# Altium project RF-lxSpark_1v0.PrjPcb (part 1 of 3)
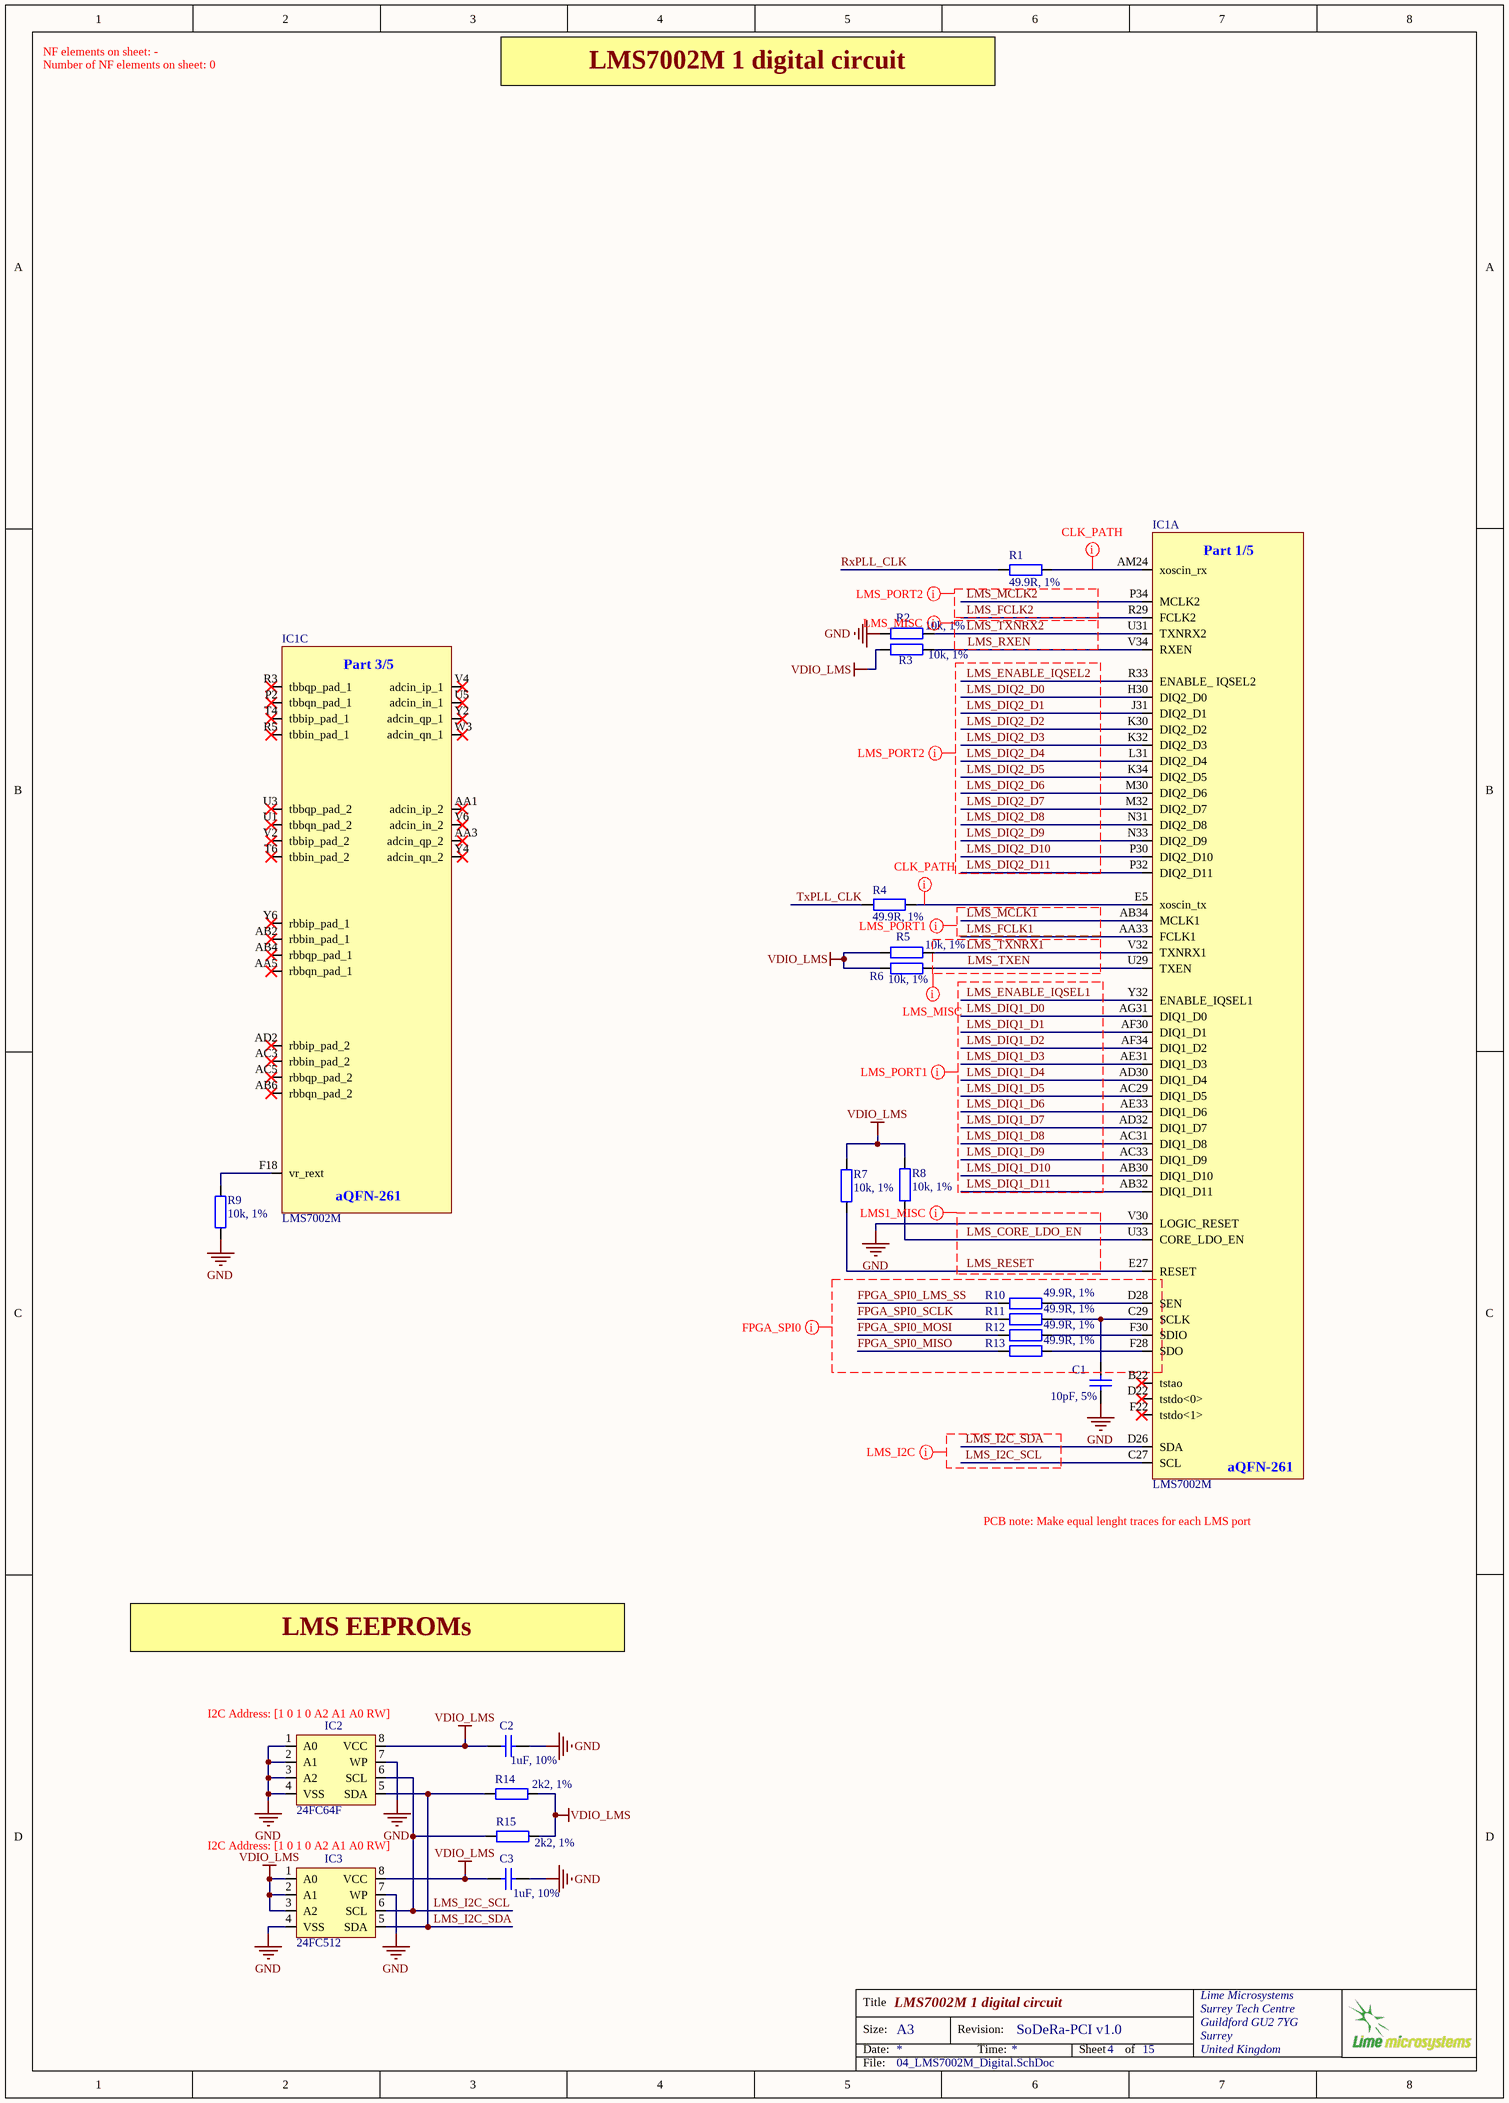
[diagram p0: 04_LMS7002M_Digital.SchDoc]
8 sheets, 396 parts. Net scope: global (net labels, ports and power ports of the same name join across sheets).
Board file: SoDeRa-PCIe_1v0.PcbDoc
Sheets:
  04_LMS7002M_Digital.SchDoc
  07_FPGA_banks_3_4_5.SchDoc
  08_FPGA_banks_6_7_8.SchDoc
  09_FPGA_misc.SchDoc
  11_DDR2.SchDoc
  12_Periphs.SchDoc
  13_Clocks_1.SchDoc
  15_BoardPowerSupply.SchDoc

## Sheet 04_LMS7002M_Digital.SchDoc: LMS7002M 1 digital circuit
size A3 portrait; Organization: Lime Microsystems; Address1: Surrey Tech Centre; Address2: Guildford GU2 7YG; Address3: Surrey; Address4: United Kingdom; Revision: SoDeRa-PCI v1.0; SheetNumber: 4; SheetTotal: 15

### Parts
C1  10pF, 5%  [CAP0402]
C2  1uF, 10%  [CAP0402]
C3  1uF, 10%  [CAP0402]
IC1  LMS7002M  [LMS7002M]  (parts A,C of 5)
IC2  24FC64F  [24FC512]
IC3  24FC512  [24FC512]
R1  49.9R, 1%  [RES0402]
R2  10k, 1%  [RES0402]
R3  10k, 1%  [RES0402]
R4  49.9R, 1%  [RES0402]
R5  10k, 1%  [RES0402]
R6  10k, 1%  [RES0402]
R7  10k, 1%  [RES0402]
R8  10k, 1%  [RES0402]
R9  10k, 1%  [RES0402]
R10  49.9R, 1%  [RES0402]
R11  49.9R, 1%  [RES0402]
R12  49.9R, 1%  [RES0402]
R13  49.9R, 1%  [RES0402]
R14  2k2, 1%  [RES0402]
R15  2k2, 1%  [RES0402]

### Nets
GND: C1.2 C2.1 C3.1 IC1.V30(LOGIC_RESET) IC2.1(A0) IC2.2(A1) IC2.3(A2) IC2.4(VSS) IC2.7(WP) IC3.4(VSS) IC3.7(WP) R2.1 R9.2
VDIO_LMS: C2.2 C3.2 IC2.8(VCC) IC3.1(A0) IC3.2(A1) IC3.3(A2) IC3.8(VCC) R3.1 R5.1 R6.1 R7.2 R8.2 R14.1 R15.1
FPGA_SPI0_LMS_SS: R10.2
FPGA_SPI0_MISO: R13.2
FPGA_SPI0_MOSI: R12.2
FPGA_SPI0_SCLK: R11.2
LMS_CORE_LDO_EN: IC1.U33(CORE_LDO_EN) R8.1
LMS_DIQ1_D0: IC1.AG31(DIQ1_D0)
LMS_DIQ1_D1: IC1.AF30(DIQ1_D1)
LMS_DIQ1_D2: IC1.AF34(DIQ1_D2)
LMS_DIQ1_D3: IC1.AE31(DIQ1_D3)
LMS_DIQ1_D4: IC1.AD30(DIQ1_D4)
LMS_DIQ1_D5: IC1.AC29(DIQ1_D5)
LMS_DIQ1_D6: IC1.AE33(DIQ1_D6)
LMS_DIQ1_D7: IC1.AD32(DIQ1_D7)
LMS_DIQ1_D8: IC1.AC31(DIQ1_D8)
LMS_DIQ1_D9: IC1.AC33(DIQ1_D9)
LMS_DIQ1_D10: IC1.AB30(DIQ1_D10)
LMS_DIQ1_D11: IC1.AB32(DIQ1_D11)
LMS_DIQ2_D0: IC1.H30(DIQ2_D0)
LMS_DIQ2_D1: IC1.J31(DIQ2_D1)
LMS_DIQ2_D2: IC1.K30(DIQ2_D2)
LMS_DIQ2_D3: IC1.K32(DIQ2_D3)
LMS_DIQ2_D4: IC1.L31(DIQ2_D4)
LMS_DIQ2_D5: IC1.K34(DIQ2_D5)
LMS_DIQ2_D6: IC1.M30(DIQ2_D6)
LMS_DIQ2_D7: IC1.M32(DIQ2_D7)
LMS_DIQ2_D8: IC1.N31(DIQ2_D8)
LMS_DIQ2_D9: IC1.N33(DIQ2_D9)
LMS_DIQ2_D10: IC1.P30(DIQ2_D10)
LMS_DIQ2_D11: IC1.P32(DIQ2_D11)
LMS_ENABLE_IQSEL1: IC1.Y32(ENABLE_IQSEL1)
LMS_ENABLE_IQSEL2: IC1.R33(ENABLE__IQSEL2)
LMS_FCLK1: IC1.AA33(FCLK1)
LMS_FCLK2: IC1.R29(FCLK2)
LMS_I2C_SCL: IC1.C27(SCL) IC2.6(SCL) IC3.6(SCL) R15.2
LMS_I2C_SDA: IC1.D26(SDA) IC2.5(SDA) IC3.5(SDA) R14.2
LMS_MCLK1: IC1.AB34(MCLK1)
LMS_MCLK2: IC1.P34(MCLK2)
LMS_RESET: IC1.E27(RESET) R7.1
LMS_RXEN: IC1.V34(RXEN) R3.2
LMS_TXEN: IC1.U29(TXEN) R6.2
LMS_TXNRX1: IC1.V32(TXNRX1) R5.2
LMS_TXNRX2: IC1.U31(TXNRX2) R2.2
RxPLL_CLK: R1.2
TxPLL_CLK: R4.2
NetC1_1: C1.1 IC1.C29(SCLK) R11.1
NetIC1_AM24: IC1.AM24(xoscin_rx) R1.1
NetIC1_D28: IC1.D28(SEN) R10.1
NetIC1_E5: IC1.E5(xoscin_tx) R4.1
NetIC1_F18: IC1.F18(vr_rext) R9.1
NetIC1_F28: IC1.F28(SDO) R13.1
NetIC1_F30: IC1.F30(SDIO) R12.1

Not connected (* = marked no-connect by the designer): IC1 AA1(adcin_ip_2)* AA3(adcin_qp_2)* AA5(rbbqn_pad_1)* AB2(rbbin_pad_1)* AB4(rbbqp_pad_1)* AB6(rbbqn_pad_2)* AC3(rbbin_pad_2)* AC5(rbbqp_pad_2)* AD2(rbbip_pad_2)* B22(tstao)* D22(tstdo<0>)* F22(tstdo<1>)* P2(tbbqn_pad_1)* R3(tbbqp_pad_1)* R5(tbbin_pad_1)* T4(tbbip_pad_1)* T6(tbbin_pad_2)* U1(tbbqn_pad_2)* U3(tbbqp_pad_2)* U5(adcin_in_1)* V2(tbbip_pad_2)* V4(adcin_ip_1)* V6(adcin_in_2)* W3(adcin_qn_1)* Y2(adcin_qp_1)* Y4(adcin_qn_2)* Y6(rbbip_pad_1)*

### Layout directives
net class CLK_PATH: NetIC1_AM24, NetIC1_E5
net class FPGA_SPI0: FPGA_SPI0_LMS_SS, FPGA_SPI0_MISO, FPGA_SPI0_MOSI, FPGA_SPI0_SCLK
net class LMS_I2C: LMS_I2C_SCL, LMS_I2C_SDA
net class LMS_PORT2: LMS_DIQ2_D0, LMS_DIQ2_D1, LMS_DIQ2_D2, LMS_DIQ2_D3, LMS_DIQ2_D4, LMS_DIQ2_D5, LMS_DIQ2_D6, LMS_DIQ2_D7, LMS_DIQ2_D8, LMS_DIQ2_D9, LMS_DIQ2_D10, LMS_DIQ2_D11, LMS_ENABLE_IQSEL2, LMS_MCLK2
net class LMS_MISC: LMS_TXEN, LMS_TXNRX1, LMS_TXNRX2
net class LMS_PORT1: LMS_DIQ1_D0, LMS_DIQ1_D1, LMS_DIQ1_D2, LMS_DIQ1_D3, LMS_DIQ1_D4, LMS_DIQ1_D5, LMS_DIQ1_D6, LMS_DIQ1_D7, LMS_DIQ1_D8, LMS_DIQ1_D9, LMS_DIQ1_D10, LMS_DIQ1_D11, LMS_ENABLE_IQSEL1, LMS_MCLK1
net class MISC_LMS1: LMS_CORE_LDO_EN, LMS_RESET

### Notes on the sheet
- NF elements on sheet: -
- Number of NF elements on sheet: 0
- LMS7002M 1 digital circuit
- (near IC1) PCB note: Make equal lenght traces for each LMS port
- LMS EEPROMs
- (near IC2) I2C Address: [1 0 1 0 A2 A1 A0 RW]
- (near IC3) I2C Address: [1 0 1 0 A2 A1 A0 RW]
- Title
- Size:
- Date:
- A3
- Revision:
- Time:
- Sheet
- of
- File:
- (in symbol LMS7002M, part A) Part 1/5; aQFN-261
- (in symbol LMS7002M, part C) Part 3/5; aQFN-261

### Library data of the parts
C1 = Cap_0402: Manufacturer Part Number 1: 04023A100JAT2A; Manufacturer: AVX; Voltage Rating: 25; Ceramic Capacitor Case: 0402 [1005 Metric]; Capacitor Case Style: 0402 [1005 Metric]<!--FANDB--><div class="features-and-benefits-container"></div>; Dielectric Characteristic: C0G / NP0; SVHC: No SVHC (16-Jun-2014); Capacitance: 10; Value: 10pF, 5%; Supplier 1: Farnell; Supplier Part Number 1: 2332478RL; Capacitance Tolerance: ± 5%; Product Range: -; RoHS: YES; Operating Temperature Min: -55; Operating Temperature Max: 125; Capacitance Tolerance ±: ± 5%; MSL: MSL 1 - Unlimited; Packaging: Cut Tape
C2 C3 = Cap_0402: Manufacturer Part Number 1: GRM155R61A105KE15J; Manufacturer: TDK; Voltage Rating: 10; Product Range: TDK - C Series; Ceramic Capacitor Case: 0402 [1005 Metric]; Capacitance: 1; Dielectric Characteristic: X6; Value: 1uF, 10%; Supplier 1: Newark; Supplier Part Number 1: 490-6298-2-ND; Capacitance Tolerance: ± 10%; MSL: -; RoHS: YES
IC2 = 24FC64F: Manufacturer Part Number 1: 24FC64F-I/ST; Manufacturer: Microchip Technology; Format - Memory: EEPROMs - Serial; Speed: 400kHz, 1MHz; Interface: I²C, 2-Wire Serial; Memory Type: EEPROM; Memory Size: 64K (8K x 8); Voltage - Supply: 1.7 V ~ 5.5 V; Supplier 1: Digi-Key; Packaging: Tube; Supplier Device Package: 8-TSSOP; Operating Temperature: -40°C ~ 85°C; RoHS: RoHS Compliant; Category: Integrated Circuits (ICs); Package / Case: 8-TSSOP (0.173", 4.40mm Width); Supplier Part Number 1: 24FC64F-I/ST-ND
IC3 = 24FC512: Manufacturer Part Number 1: 24FC512-I/ST; Manufacturer: Microchip Technology; Speed: 400kHz, 1MHz; Memory Type: EEPROM; Memory Size: 512K (64K x 8); Voltage - Supply: 1.7 V ~ 5.5 V; Interface: I²C, 2-Wire Serial; Format - Memory: EEPROMs - Serial; Supplier 1: Digi-Key; RoHS: RoHS Compliant; Packaging: Tube; Operating Temperature: -40°C ~ 85°C; Supplier Device Package: 8-TSSOP; Category: Integrated Circuits (ICs); Package / Case: 8-TSSOP (0.173", 4.40mm Width); Supplier Part Number 1: 24FC512-I/ST-ND
R1 R4 R10-R13 = Res_0402: Manufacturer: Samsung Electro-Mechanics America, Inc.; Manufacturer Part Number: RC1005F49R9CS; Temperature Coefficient: ±100ppm/°C; Resistance (Ohms): 49.9; Power (Watts): 0.063W, 1/16W; Number of Terminations: 2; Size / Dimension: 0.039" L x 0.020" W (1.00mm x 0.50mm); Supplier Device Package: 0402 (1005 Metric); RoHS: RoHS Compliant; Supplier Part Number 1: 1276-3469-6-ND; Features: -; Packaging: Digi-Reel®; Tolerance: ±1%; Height: 0.016" (0.40mm); Category: Resistors; Composition: Thick Film; Package / Case: 0402 (1005 Metric); Supplier 1: Digi-Key; Operating Temperature: -55°C ~ 155°C; Value: 49.9R, 1%
R2 R3 R5-R9 = Res_0402: Manufacturer: Yageo; Manufacturer Part Number 1: RC0402FR-0710KL; Temperature Coefficient: ±100ppm/°C; Power (Watts): 0.063W, 1/16W; Value: 10k, 1%; Supplier 1: Digi-Key; Supplier Part Number 1: 311-10.0KLRTR-ND; Resistance (Ohms): 10k; Packaging: Tape & Reel (TR); RoHS: RoHS Compliant; Package / Case: 0402 (1005 Metric); Tolerance: ±1%; Operating Temperature: -55°C ~ 155°C; Size / Dimension: 0.039" L x 0.020" W (1.00mm x 0.50mm); Number of Terminations: 2; Category: Resistors; Height: 0.016" (0.40mm); Supplier Device Package: 0402; Features: Moisture Resistant; Composition: Thick Film
R14 R15 = Res_0402: Manufacturer: Stackpole Electronics Inc; Manufacturer Part Number 1: RMCF0402FT2K20; Resistance (Ohms): 2.2k; Temperature Coefficient: ±100ppm/°C; Power (Watts): 0.063W, 1/16W; Value: 2k2, 1%; Supplier 1: Digi-Key; Supplier Part Number 1: RMCF0402FT2K20CT-ND; Supplier Device Package: 0402; Package / Case: 0402 (1005 Metric); Size / Dimension: 0.039" L x 0.020" W (1.00mm x 0.50mm); Operating Temperature: -55°C ~ 155°C; Composition: Thick Film; Category: Resistors; Features: -; Height: 0.016" (0.40mm); RoHS: RoHS Compliant; Number of Terminations: 2; Packaging: Cut Tape (CT); Tolerance: ±1%
IC1 = LMS7002M: Manufacturer Part Number 1: LMS7002M; Supplier 1: Lime Microsystems; Supplier Part Number 1: Lime Microsystems

## Sheet 07_FPGA_banks_3_4_5.SchDoc: FPGA banks 3, 4, 5
size A3; Organization: Lime Microsystems; Address1: Surrey Tech Centre; Address2: Guildford GU2 7YG; Address3: Surrey; Address4: United Kingdom; Revision: SoDeRa-PCI v1.0; SheetNumber: 7; SheetTotal: 15
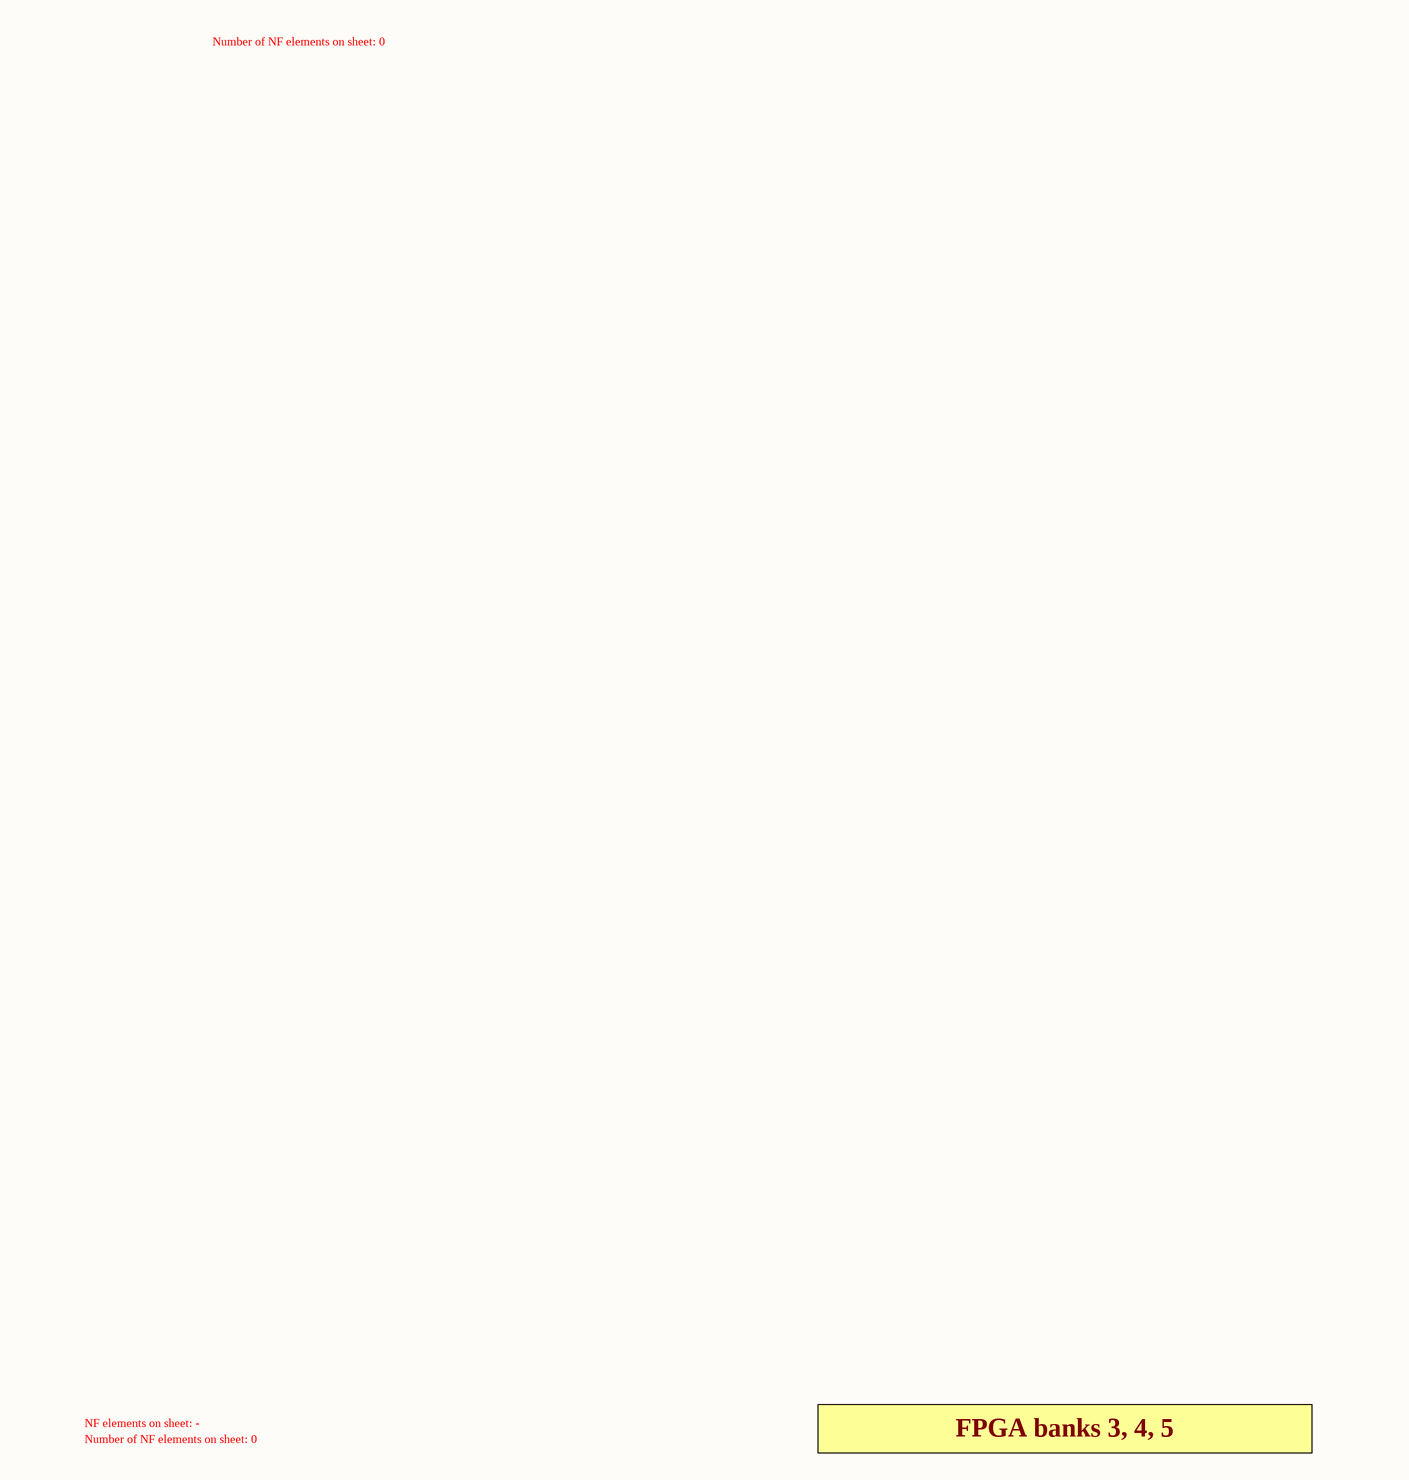
[diagram p1: 07_FPGA_banks_3_4_5.SchDoc, top]
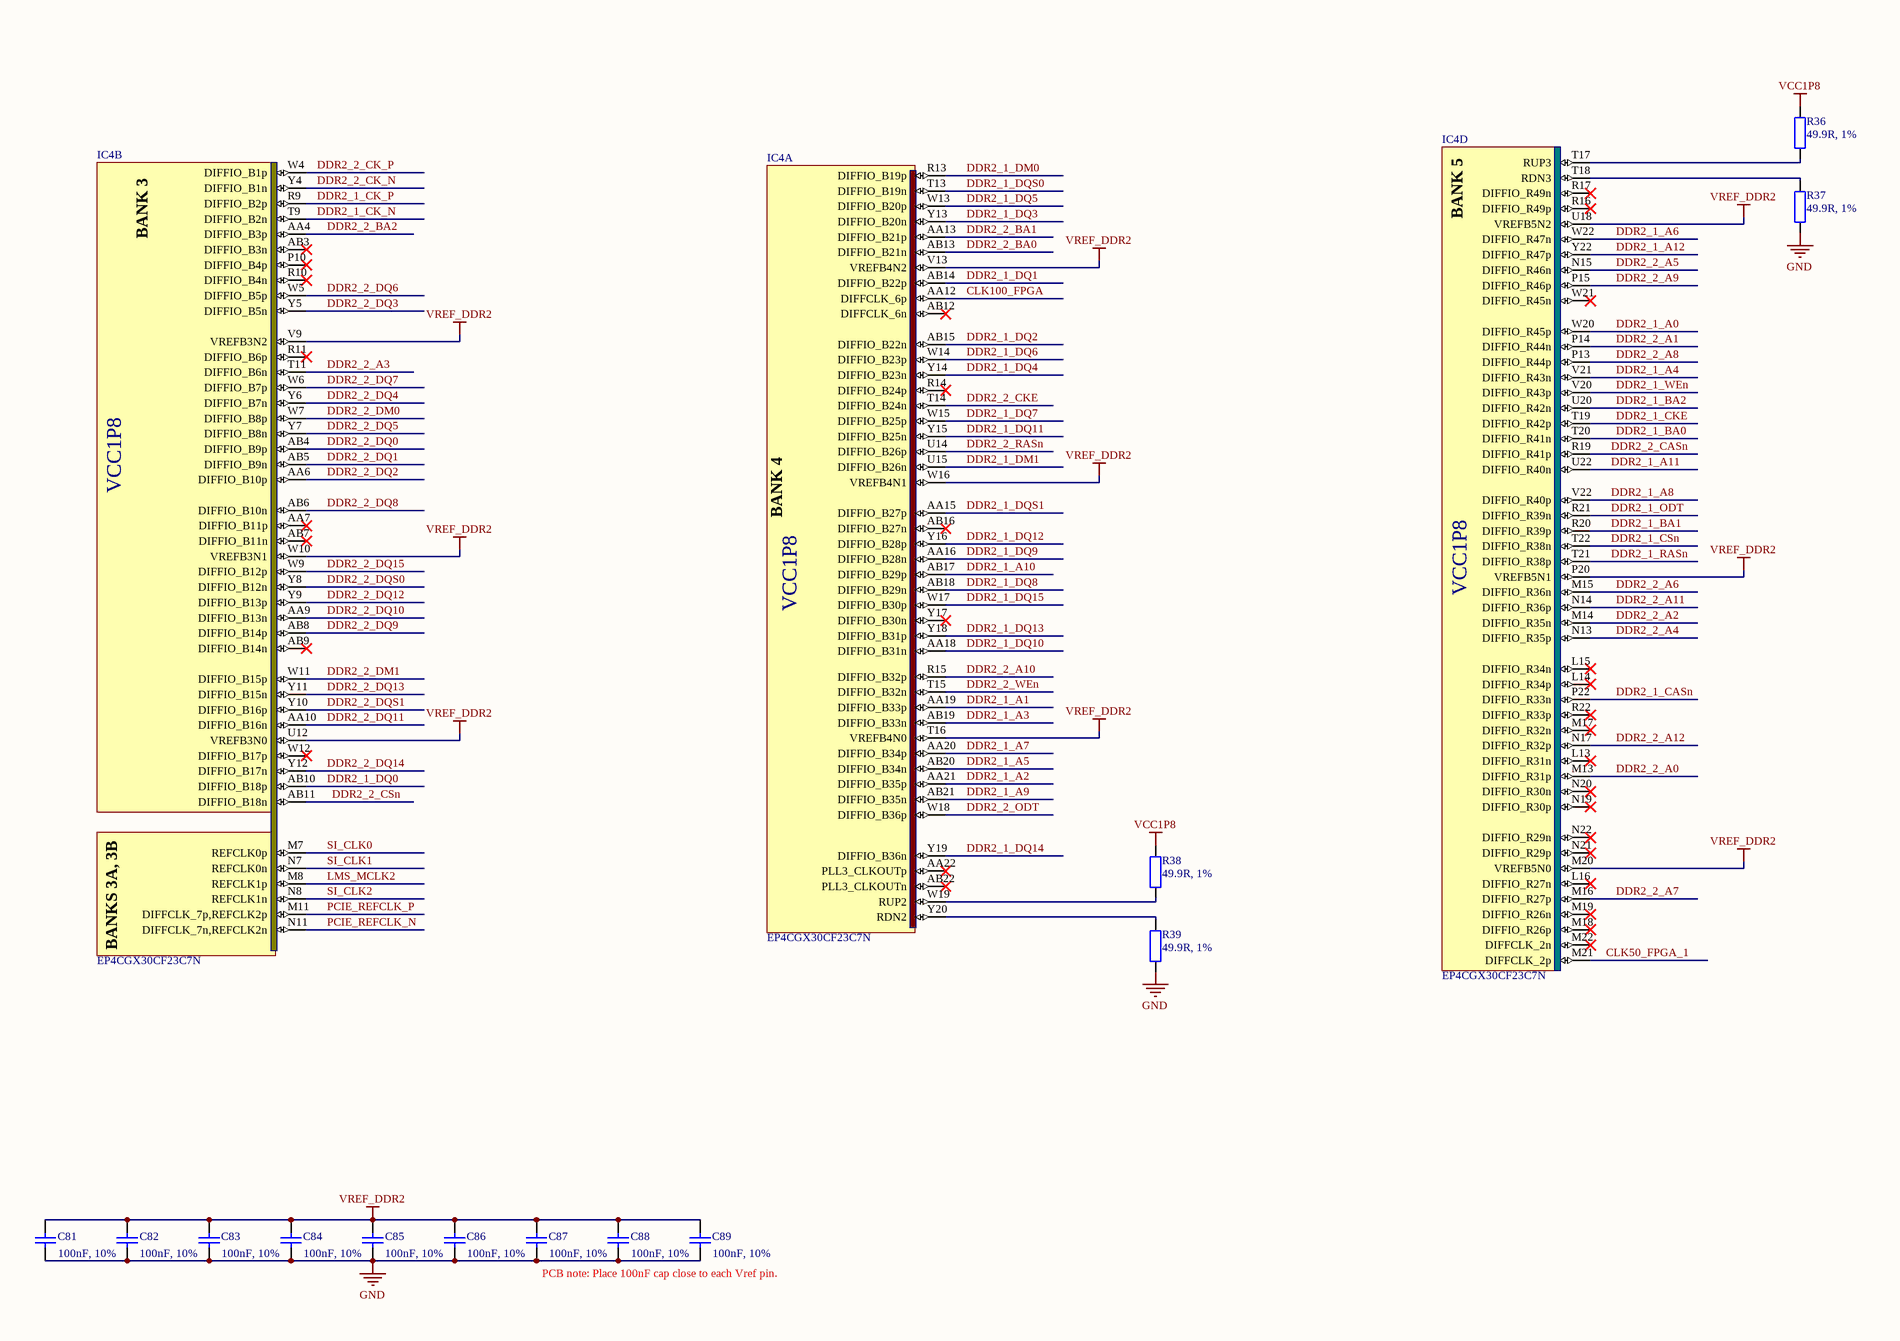
[diagram p2: 07_FPGA_banks_3_4_5.SchDoc, bottom]

### Parts
C81  100nF, 10%  [CAP0402]
C82  100nF, 10%  [CAP0402]
C83  100nF, 10%  [CAP0402]
C84  100nF, 10%  [CAP0402]
C85  100nF, 10%  [CAP0402]
C86  100nF, 10%  [CAP0402]
C87  100nF, 10%  [CAP0402]
C88  100nF, 10%  [CAP0402]
C89  100nF, 10%  [CAP0402]
IC4  EP4CGX30CF23C7N  [ALTR-FBGA484_A-200]  (parts A,B,D of 10)
R36  49.9R, 1%  [RES0402]
R37  49.9R, 1%  [RES0402]
R38  49.9R, 1%  [RES0402]
R39  49.9R, 1%  [RES0402]

### Nets
GND: C81.2 C82.2 C83.2 C84.2 C85.2 C86.2 C87.2 C88.2 C89.2 R37.1 R39.1
VCC1P8: R36.2 R38.2
VREF_DDR2: C81.1 C82.1 C83.1 C84.1 C85.1 C86.1 C87.1 C88.1 C89.1 IC4.M20(VREFB5N0) IC4.P20(VREFB5N1) IC4.T16(VREFB4N0) IC4.U12(VREFB3N0) IC4.U18(VREFB5N2) IC4.V9(VREFB3N2) IC4.V13(VREFB4N2) IC4.W10(VREFB3N1) IC4.W16(VREFB4N1)
CLK50_FPGA_1: IC4.M21(DIFFCLK_2p)
CLK100_FPGA: IC4.AA12(DIFFCLK_6p)
DDR2_1_A0: IC4.W20(DIFFIO_R45p)
DDR2_1_A1: IC4.AA19(DIFFIO_B33p)
DDR2_1_A2: IC4.AA21(DIFFIO_B35p)
DDR2_1_A3: IC4.AB19(DIFFIO_B33n)
DDR2_1_A4: IC4.V21(DIFFIO_R43n)
DDR2_1_A5: IC4.AB20(DIFFIO_B34n)
DDR2_1_A6: IC4.W22(DIFFIO_R47n)
DDR2_1_A7: IC4.AA20(DIFFIO_B34p)
DDR2_1_A8: IC4.V22(DIFFIO_R40p)
DDR2_1_A9: IC4.AB21(DIFFIO_B35n)
DDR2_1_A10: IC4.AB17(DIFFIO_B29p)
DDR2_1_A11: IC4.U22(DIFFIO_R40n)
DDR2_1_A12: IC4.Y22(DIFFIO_R47p)
DDR2_1_BA0: IC4.T20(DIFFIO_R41n)
DDR2_1_BA1: IC4.R20(DIFFIO_R39p)
DDR2_1_BA2: IC4.U20(DIFFIO_R42n)
DDR2_1_CASn: IC4.P22(DIFFIO_R33n)
DDR2_1_CK_N: IC4.T9(DIFFIO_B2n)
DDR2_1_CK_P: IC4.R9(DIFFIO_B2p)
DDR2_1_CKE: IC4.T19(DIFFIO_R42p)
DDR2_1_CSn: IC4.T22(DIFFIO_R38n)
DDR2_1_DM0: IC4.R13(DIFFIO_B19p)
DDR2_1_DM1: IC4.U15(DIFFIO_B26n)
DDR2_1_DQ0: IC4.AB10(DIFFIO_B18p)
DDR2_1_DQ1: IC4.AB14(DIFFIO_B22p)
DDR2_1_DQ2: IC4.AB15(DIFFIO_B22n)
DDR2_1_DQ3: IC4.Y13(DIFFIO_B20n)
DDR2_1_DQ4: IC4.Y14(DIFFIO_B23n)
DDR2_1_DQ5: IC4.W13(DIFFIO_B20p)
DDR2_1_DQ6: IC4.W14(DIFFIO_B23p)
DDR2_1_DQ7: IC4.W15(DIFFIO_B25p)
DDR2_1_DQ8: IC4.AB18(DIFFIO_B29n)
DDR2_1_DQ9: IC4.AA16(DIFFIO_B28n)
DDR2_1_DQ10: IC4.AA18(DIFFIO_B31n)
DDR2_1_DQ11: IC4.Y15(DIFFIO_B25n)
DDR2_1_DQ12: IC4.Y16(DIFFIO_B28p)
DDR2_1_DQ13: IC4.Y18(DIFFIO_B31p)
DDR2_1_DQ14: IC4.Y19(DIFFIO_B36n)
DDR2_1_DQ15: IC4.W17(DIFFIO_B30p)
DDR2_1_DQS0: IC4.T13(DIFFIO_B19n)
DDR2_1_DQS1: IC4.AA15(DIFFIO_B27p)
DDR2_1_ODT: IC4.R21(DIFFIO_R39n)
DDR2_1_RASn: IC4.T21(DIFFIO_R38p)
DDR2_1_WEn: IC4.V20(DIFFIO_R43p)
DDR2_2_A0: IC4.M13(DIFFIO_R31p)
DDR2_2_A1: IC4.P14(DIFFIO_R44n)
DDR2_2_A2: IC4.M14(DIFFIO_R35n)
DDR2_2_A3: IC4.T11(DIFFIO_B6n)
DDR2_2_A4: IC4.N13(DIFFIO_R35p)
DDR2_2_A5: IC4.N15(DIFFIO_R46n)
DDR2_2_A6: IC4.M15(DIFFIO_R36n)
DDR2_2_A7: IC4.M16(DIFFIO_R27p)
DDR2_2_A8: IC4.P13(DIFFIO_R44p)
DDR2_2_A9: IC4.P15(DIFFIO_R46p)
DDR2_2_A10: IC4.R15(DIFFIO_B32p)
DDR2_2_A11: IC4.N14(DIFFIO_R36p)
DDR2_2_A12: IC4.N17(DIFFIO_R32p)
DDR2_2_BA0: IC4.AB13(DIFFIO_B21n)
DDR2_2_BA1: IC4.AA13(DIFFIO_B21p)
DDR2_2_BA2: IC4.AA4(DIFFIO_B3p)
DDR2_2_CASn: IC4.R19(DIFFIO_R41p)
DDR2_2_CK_N: IC4.Y4(DIFFIO_B1n)
DDR2_2_CK_P: IC4.W4(DIFFIO_B1p)
DDR2_2_CKE: IC4.T14(DIFFIO_B24n)
DDR2_2_CSn: IC4.AB11(DIFFIO_B18n)
DDR2_2_DM0: IC4.W7(DIFFIO_B8p)
DDR2_2_DM1: IC4.W11(DIFFIO_B15p)
DDR2_2_DQ0: IC4.AB4(DIFFIO_B9p)
DDR2_2_DQ1: IC4.AB5(DIFFIO_B9n)
DDR2_2_DQ2: IC4.AA6(DIFFIO_B10p)
DDR2_2_DQ3: IC4.Y5(DIFFIO_B5n)
DDR2_2_DQ4: IC4.Y6(DIFFIO_B7n)
DDR2_2_DQ5: IC4.Y7(DIFFIO_B8n)
DDR2_2_DQ6: IC4.W5(DIFFIO_B5p)
DDR2_2_DQ7: IC4.W6(DIFFIO_B7p)
DDR2_2_DQ8: IC4.AB6(DIFFIO_B10n)
DDR2_2_DQ9: IC4.AB8(DIFFIO_B14p)
DDR2_2_DQ10: IC4.AA9(DIFFIO_B13n)
DDR2_2_DQ11: IC4.AA10(DIFFIO_B16n)
DDR2_2_DQ12: IC4.Y9(DIFFIO_B13p)
DDR2_2_DQ13: IC4.Y11(DIFFIO_B15n)
DDR2_2_DQ14: IC4.Y12(DIFFIO_B17n)
DDR2_2_DQ15: IC4.W9(DIFFIO_B12p)
DDR2_2_DQS0: IC4.Y8(DIFFIO_B12n)
DDR2_2_DQS1: IC4.Y10(DIFFIO_B16p)
DDR2_2_ODT: IC4.W18(DIFFIO_B36p)
DDR2_2_RASn: IC4.U14(DIFFIO_B26p)
DDR2_2_WEn: IC4.T15(DIFFIO_B32n)
LMS_MCLK2: IC4.M8(REFCLK1p)
PCIE_REFCLK_N: IC4.N11(DIFFCLK_7n,REFCLK2n)
PCIE_REFCLK_P: IC4.M11(DIFFCLK_7p,REFCLK2p)
SI_CLK0: IC4.M7(REFCLK0p)
SI_CLK1: IC4.N7(REFCLK0n)
SI_CLK2: IC4.N8(REFCLK1n)
NetIC4_T17: IC4.T17(RUP3) R36.1
NetIC4_T18: IC4.T18(RDN3) R37.2
NetIC4_W19: IC4.W19(RUP2) R38.1
NetIC4_Y20: IC4.Y20(RDN2) R39.2

Not connected (* = marked no-connect by the designer): IC4 AA7(DIFFIO_B11p)* AA22(PLL3_CLKOUTp)* AB3(DIFFIO_B3n)* AB7(DIFFIO_B11n)* AB9(DIFFIO_B14n)* AB12(DIFFCLK_6n)* AB16(DIFFIO_B27n)* AB22(PLL3_CLKOUTn)* L13(DIFFIO_R31n)* L14(DIFFIO_R34p)* L15(DIFFIO_R34n)* L16(DIFFIO_R27n)* M17(DIFFIO_R32n)* M18(DIFFIO_R26p)* M19(DIFFIO_R26n)* M22(DIFFCLK_2n)* N19(DIFFIO_R30p)* N20(DIFFIO_R30n)* N21(DIFFIO_R29p)* N22(DIFFIO_R29n)* P10(DIFFIO_B4p)* R10(DIFFIO_B4n)* R11(DIFFIO_B6p)* R14(DIFFIO_B24p)* R16(DIFFIO_R49p)* R17(DIFFIO_R49n)* R22(DIFFIO_R33p)* W12(DIFFIO_B17p)* W21(DIFFIO_R45n)* Y17(DIFFIO_B30n)*

### Notes on the sheet
- Number of NF elements on sheet: 0
- NF elements on sheet: -
- FPGA banks 3, 4, 5
- VCC1P8
- PCB note: Place 100nF cap close to each Vref pin.
- Title
- Size:
- Date:
- A3
- Revision:
- Time:
- Sheet
- of
- File:
- (in symbol EP4CGX30CF23C7N, part A) BANK 4
- (in symbol EP4CGX30CF23C7N, part B) BANK 3; BANKS 3A, 3B
- (in symbol EP4CGX30CF23C7N, part D) BANK 5

### Library data of the parts
C81-C89 = Cap_0603: Manufacturer: Murata; Manufacturer Part Number 1: GRM155R71C104KA88D; Brand: Murata Electronics; Type: General Purpose MLCC; Capacitance: 0.1 uF; Temperature Coefficient / Code: +/- 15 %; Voltage Rating DC: 16 V; Supplier 1: Mouser; Supplier Part Number 1: 81-GRM155R71C104KA88; Tolerance: 10 %; Case Code - in: 0402; Category: Multilayer Ceramic Capacitors MLCC - SMD/SMT; Value: 100nF, 10%; Manufacturer Part Number: GRM155R71C104KA88D
IC4 = EP4CGX30CF23C7N: Manufacturer: Altera; Voltage - Supply: 1.16 V ~ 1.24 V; Number of I/O: 290; Total RAM Bits: 1105920; Number of Logic Elements/Cells: 29440; Number of LABs/CLBs: 1840; Supplier 1: Digi-Key; Package / Case: 484-BGA; Operating Temperature: 0°C ~ 85°C; Mounting Type: Surface Mount; Number of Gates: -; Supplier Device Package: 484-FBGA (23x23); Category: Integrated Circuits (ICs); RoHS: RoHS Compliant; Supplier Part Number 1: 544-2730-ND; Manufacturer Part Number 1: EP4CGX30CF23C7N
R36-R39 = Res_0402: as R1 on sheet 04_LMS7002M_Digital; Number of Terminations: 2; Size / Dimension: 0.039" L x 0.020" W (1.00mm x 0.50mm); Supplier Device Package: 0402 (1005 Metric); RoHS: RoHS Compliant; Supplier Part Number 1: 1276-3469-6-ND; Features: -; Packaging: Digi-Reel®; Tolerance: ±1%; Height: 0.016" (0.40mm); Category: Resistors; Composition: Thick Film; Package / Case: 0402 (1005 Metric); Supplier 1: Digi-Key; Operating Temperature: -55°C ~ 155°C; Value: 49.9R, 1%

## Sheet 08_FPGA_banks_6_7_8.SchDoc: FPGA banks 6, 7, 8
size A3; Organization: Lime Microsystems; Address1: Surrey Tech Centre; Address2: Guildford GU2 7YG; Address3: Surrey; Address4: United Kingdom; Revision: SoDeRa-PCI v1.0; SheetNumber: 8; SheetTotal: 15
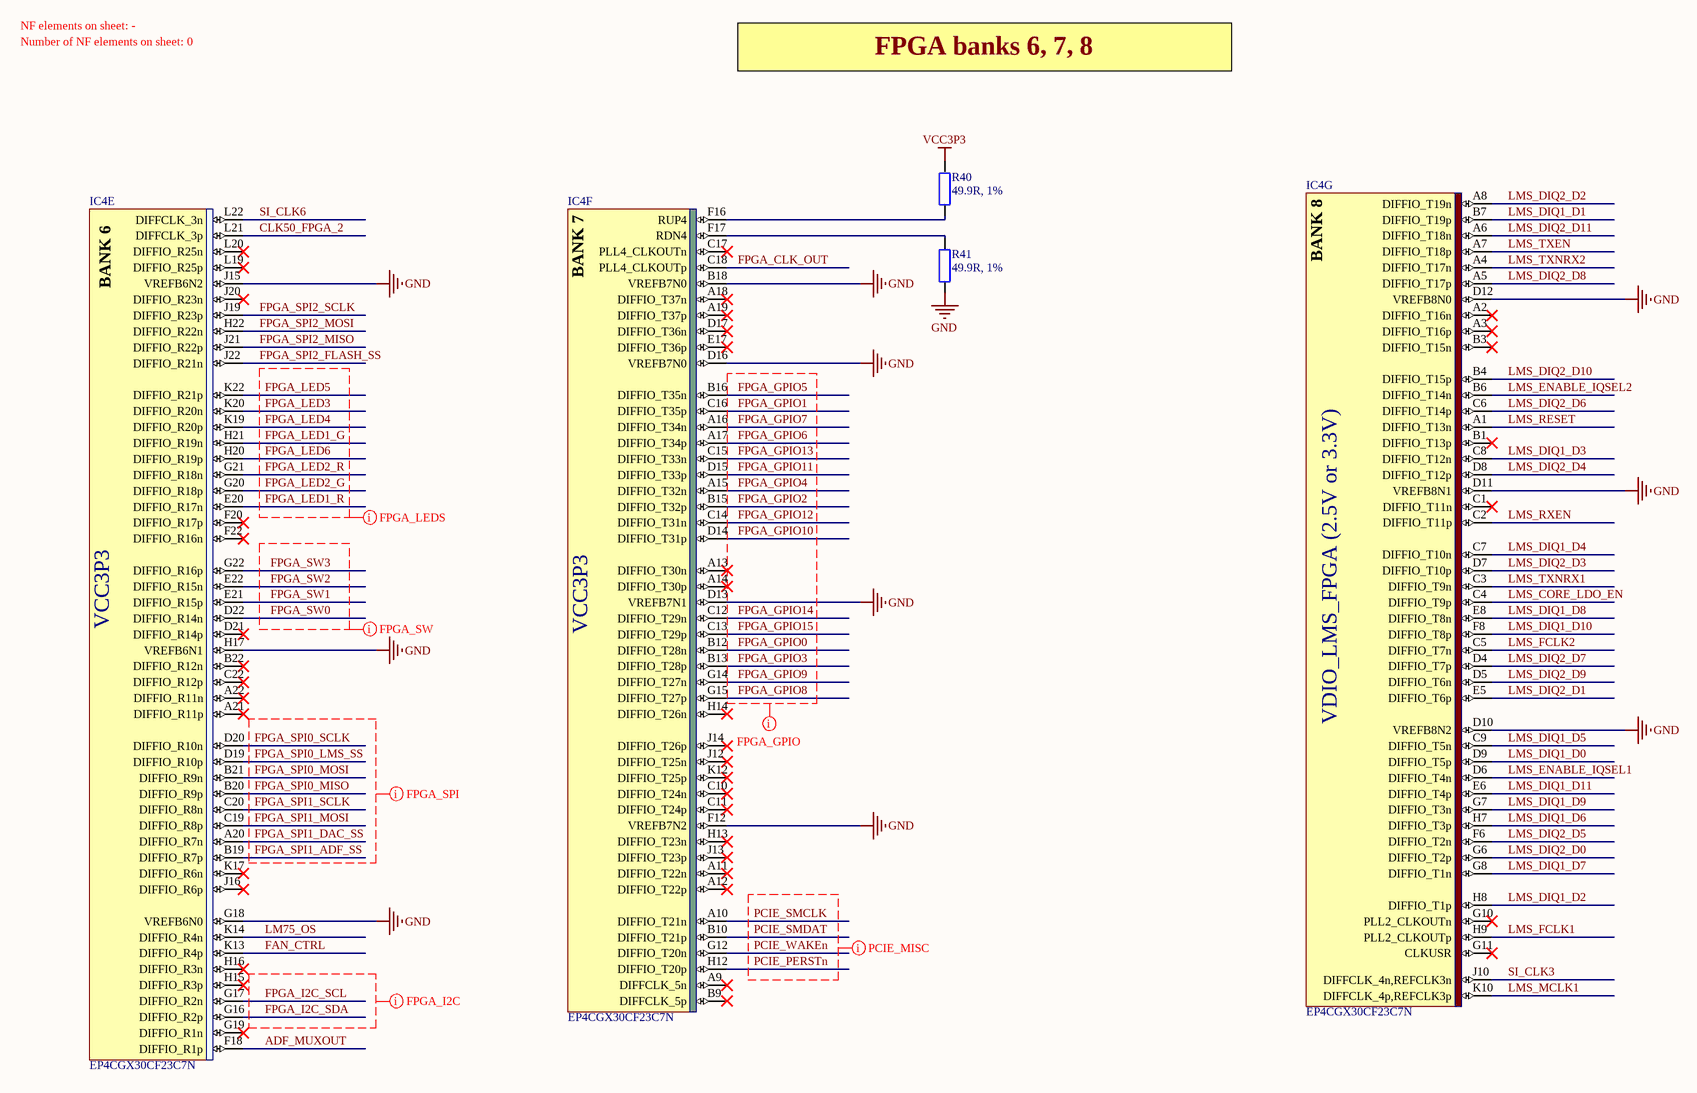
[diagram p3: 08_FPGA_banks_6_7_8.SchDoc]

### Parts
IC4  EP4CGX30CF23C7N  [ALTR-FBGA484_A-200]  (parts E,F,G of 10)
R40  49.9R, 1%  [RES0402]
R41  49.9R, 1%  [RES0402]

### Nets
GND: IC4.B18(VREFB7N0) IC4.D10(VREFB8N2) IC4.D11(VREFB8N1) IC4.D12(VREFB8N0) IC4.D13(VREFB7N1) IC4.D16(VREFB7N0) IC4.F12(VREFB7N2) IC4.G18(VREFB6N0) IC4.H17(VREFB6N1) IC4.J15(VREFB6N2) R41.1
VCC3P3: R40.2
ADF_MUXOUT: IC4.F18(DIFFIO_R1p)
CLK50_FPGA_2: IC4.L21(DIFFCLK_3p)
FAN_CTRL: IC4.K13(DIFFIO_R4p)
FPGA_CLK_OUT: IC4.C18(PLL4_CLKOUTp)
FPGA_GPIO0: IC4.B12(DIFFIO_T28n)
FPGA_GPIO1: IC4.C16(DIFFIO_T35p)
FPGA_GPIO2: IC4.B15(DIFFIO_T32p)
FPGA_GPIO3: IC4.B13(DIFFIO_T28p)
FPGA_GPIO4: IC4.A15(DIFFIO_T32n)
FPGA_GPIO5: IC4.B16(DIFFIO_T35n)
FPGA_GPIO6: IC4.A17(DIFFIO_T34p)
FPGA_GPIO7: IC4.A16(DIFFIO_T34n)
FPGA_GPIO8: IC4.G15(DIFFIO_T27p)
FPGA_GPIO9: IC4.G14(DIFFIO_T27n)
FPGA_GPIO10: IC4.D14(DIFFIO_T31p)
FPGA_GPIO11: IC4.D15(DIFFIO_T33p)
FPGA_GPIO12: IC4.C14(DIFFIO_T31n)
FPGA_GPIO13: IC4.C15(DIFFIO_T33n)
FPGA_GPIO14: IC4.C12(DIFFIO_T29n)
FPGA_GPIO15: IC4.C13(DIFFIO_T29p)
FPGA_I2C_SCL: IC4.G17(DIFFIO_R2n)
FPGA_I2C_SDA: IC4.G16(DIFFIO_R2p)
FPGA_LED1_G: IC4.H21(DIFFIO_R19n)
FPGA_LED1_R: IC4.E20(DIFFIO_R17n)
FPGA_LED2_G: IC4.G20(DIFFIO_R18p)
FPGA_LED2_R: IC4.G21(DIFFIO_R18n)
FPGA_LED3: IC4.K20(DIFFIO_R20n)
FPGA_LED4: IC4.K19(DIFFIO_R20p)
FPGA_LED5: IC4.K22(DIFFIO_R21p)
FPGA_LED6: IC4.H20(DIFFIO_R19p)
FPGA_SPI0_LMS_SS: IC4.D19(DIFFIO_R10p)
FPGA_SPI0_MISO: IC4.B20(DIFFIO_R9p)
FPGA_SPI0_MOSI: IC4.B21(DIFFIO_R9n)
FPGA_SPI0_SCLK: IC4.D20(DIFFIO_R10n)
FPGA_SPI1_ADF_SS: IC4.B19(DIFFIO_R7p)
FPGA_SPI1_DAC_SS: IC4.A20(DIFFIO_R7n)
FPGA_SPI1_MOSI: IC4.C19(DIFFIO_R8p)
FPGA_SPI1_SCLK: IC4.C20(DIFFIO_R8n)
FPGA_SPI2_FLASH_SS: IC4.J22(DIFFIO_R21n)
FPGA_SPI2_MISO: IC4.J21(DIFFIO_R22p)
FPGA_SPI2_MOSI: IC4.H22(DIFFIO_R22n)
FPGA_SPI2_SCLK: IC4.J19(DIFFIO_R23p)
FPGA_SW0: IC4.D22(DIFFIO_R14n)
FPGA_SW1: IC4.E21(DIFFIO_R15p)
FPGA_SW2: IC4.E22(DIFFIO_R15n)
FPGA_SW3: IC4.G22(DIFFIO_R16p)
LM75_OS: IC4.K14(DIFFIO_R4n)
LMS_CORE_LDO_EN: IC4.C4(DIFFIO_T9p)
LMS_DIQ1_D0: IC4.D9(DIFFIO_T5p)
LMS_DIQ1_D1: IC4.B7(DIFFIO_T19p)
LMS_DIQ1_D2: IC4.H8(DIFFIO_T1p)
LMS_DIQ1_D3: IC4.C8(DIFFIO_T12n)
LMS_DIQ1_D4: IC4.C7(DIFFIO_T10n)
LMS_DIQ1_D5: IC4.C9(DIFFIO_T5n)
LMS_DIQ1_D6: IC4.H7(DIFFIO_T3p)
LMS_DIQ1_D7: IC4.G8(DIFFIO_T1n)
LMS_DIQ1_D8: IC4.E8(DIFFIO_T8n)
LMS_DIQ1_D9: IC4.G7(DIFFIO_T3n)
LMS_DIQ1_D10: IC4.F8(DIFFIO_T8p)
LMS_DIQ1_D11: IC4.E6(DIFFIO_T4p)
LMS_DIQ2_D0: IC4.G6(DIFFIO_T2p)
LMS_DIQ2_D1: IC4.E5(DIFFIO_T6p)
LMS_DIQ2_D2: IC4.A8(DIFFIO_T19n)
LMS_DIQ2_D3: IC4.D7(DIFFIO_T10p)
LMS_DIQ2_D4: IC4.D8(DIFFIO_T12p)
LMS_DIQ2_D5: IC4.F6(DIFFIO_T2n)
LMS_DIQ2_D6: IC4.C6(DIFFIO_T14p)
LMS_DIQ2_D7: IC4.D4(DIFFIO_T7p)
LMS_DIQ2_D8: IC4.A5(DIFFIO_T17p)
LMS_DIQ2_D9: IC4.D5(DIFFIO_T6n)
LMS_DIQ2_D10: IC4.B4(DIFFIO_T15p)
LMS_DIQ2_D11: IC4.A6(DIFFIO_T18n)
LMS_ENABLE_IQSEL1: IC4.D6(DIFFIO_T4n)
LMS_ENABLE_IQSEL2: IC4.B6(DIFFIO_T14n)
LMS_FCLK1: IC4.H9(PLL2_CLKOUTp)
LMS_FCLK2: IC4.C5(DIFFIO_T7n)
LMS_MCLK1: IC4.K10(DIFFCLK_4p,REFCLK3p)
LMS_RESET: IC4.A1(DIFFIO_T13n)
LMS_RXEN: IC4.C2(DIFFIO_T11p)
LMS_TXEN: IC4.A7(DIFFIO_T18p)
LMS_TXNRX1: IC4.C3(DIFFIO_T9n)
LMS_TXNRX2: IC4.A4(DIFFIO_T17n)
PCIE_PERSTn: IC4.H12(DIFFIO_T20p)
PCIE_SMCLK: IC4.A10(DIFFIO_T21n)
PCIE_SMDAT: IC4.B10(DIFFIO_T21p)
PCIE_WAKEn: IC4.G12(DIFFIO_T20n)
SI_CLK3: IC4.J10(DIFFCLK_4n,REFCLK3n)
SI_CLK6: IC4.L22(DIFFCLK_3n)
NetIC4_F16: IC4.F16(RUP4) R40.1
NetIC4_F17: IC4.F17(RDN4) R41.2

Not connected (* = marked no-connect by the designer): IC4 A2(DIFFIO_T16n)* A3(DIFFIO_T16p)* A9(DIFFCLK_5n)* A11(DIFFIO_T22n)* A12(DIFFIO_T22p)* A13(DIFFIO_T30n)* A14(DIFFIO_T30p)* A18(DIFFIO_T37n)* A19(DIFFIO_T37p)* A21(DIFFIO_R11p)* A22(DIFFIO_R11n)* B1(DIFFIO_T13p)* B3(DIFFIO_T15n)* B9(DIFFCLK_5p)* B22(DIFFIO_R12n)* C1(DIFFIO_T11n)* C10(DIFFIO_T24n)* C11(DIFFIO_T24p)* C17(PLL4_CLKOUTn)* C22(DIFFIO_R12p)* D17(DIFFIO_T36n)* D21(DIFFIO_R14p)* E17(DIFFIO_T36p)* F20(DIFFIO_R17p)* F22(DIFFIO_R16n)* G10(PLL2_CLKOUTn)* G11(CLKUSR)* G19(DIFFIO_R1n)* H13(DIFFIO_T23n)* H14(DIFFIO_T26n)* H15(DIFFIO_R3p)* H16(DIFFIO_R3n)* J12(DIFFIO_T25n)* J13(DIFFIO_T23p)* J14(DIFFIO_T26p)* J16(DIFFIO_R6p)* J20(DIFFIO_R23n)* K12(DIFFIO_T25p)* K17(DIFFIO_R6n)* L19(DIFFIO_R25p)* L20(DIFFIO_R25n)*

### Layout directives
net class FPGA_GPIO: FPGA_GPIO0, FPGA_GPIO1, FPGA_GPIO2, FPGA_GPIO3, FPGA_GPIO4, FPGA_GPIO5, FPGA_GPIO6, FPGA_GPIO7, FPGA_GPIO8, FPGA_GPIO9, FPGA_GPIO10, FPGA_GPIO11, FPGA_GPIO12, FPGA_GPIO13, FPGA_GPIO14, FPGA_GPIO15
net class FPGA_LEDS: FPGA_LED1_G, FPGA_LED1_R, FPGA_LED2_G, FPGA_LED2_R, FPGA_LED3, FPGA_LED4, FPGA_LED5, FPGA_LED6
net class FPGA_SW: FPGA_SW0, FPGA_SW1, FPGA_SW2, FPGA_SW3
net class PCIE_MISC: PCIE_PERSTn, PCIE_SMCLK, PCIE_SMDAT, PCIE_WAKEn
net class FPGA_SPI: FPGA_SPI0_LMS_SS, FPGA_SPI0_MISO, FPGA_SPI0_MOSI, FPGA_SPI0_SCLK, FPGA_SPI1_ADF_SS, FPGA_SPI1_DAC_SS, FPGA_SPI1_MOSI, FPGA_SPI1_SCLK
net class FPGA_I2C: FPGA_I2C_SCL, FPGA_I2C_SDA

### Notes on the sheet
- NF elements on sheet: -
- Number of NF elements on sheet: 0
- FPGA banks 6, 7, 8
- VCC3P3
- VDIO_LMS_FPGA (2.5V or 3.3V)
- Title
- Size:
- Date:
- A3
- Revision:
- Time:
- Sheet
- of
- File:
- (in symbol EP4CGX30CF23C7N, part E) BANK 6
- (in symbol EP4CGX30CF23C7N, part F) BANK 7
- (in symbol EP4CGX30CF23C7N, part G) BANK 8

### Library data of the parts
IC4 = EP4CGX30CF23C7N: as IC4 on sheet 07_FPGA_banks_3_4_5; Supplier 1: Digi-Key; Package / Case: 484-BGA; Operating Temperature: 0°C ~ 85°C; Mounting Type: Surface Mount; Number of Gates: -; Supplier Device Package: 484-FBGA (23x23); Category: Integrated Circuits (ICs); RoHS: RoHS Compliant; Supplier Part Number 1: 544-2730-ND; Manufacturer Part Number 1: EP4CGX30CF23C7N
R40 R41 = Res_0402: as R1 on sheet 04_LMS7002M_Digital; Number of Terminations: 2; Size / Dimension: 0.039" L x 0.020" W (1.00mm x 0.50mm); Supplier Device Package: 0402 (1005 Metric); RoHS: RoHS Compliant; Supplier Part Number 1: 1276-3469-6-ND; Features: -; Packaging: Digi-Reel®; Tolerance: ±1%; Height: 0.016" (0.40mm); Category: Resistors; Composition: Thick Film; Package / Case: 0402 (1005 Metric); Supplier 1: Digi-Key; Operating Temperature: -55°C ~ 155°C; Value: 49.9R, 1%

## Sheet 09_FPGA_misc.SchDoc: FPGA misc
size A3; Organization: Lime Microsystems; Address1: Surrey Tech Centre; Address2: Guildford GU2 7YG; Address3: Surrey; Address4: United Kingdom; Revision: SoDeRa-PCI v1.0; SheetNumber: 9; SheetTotal: 15
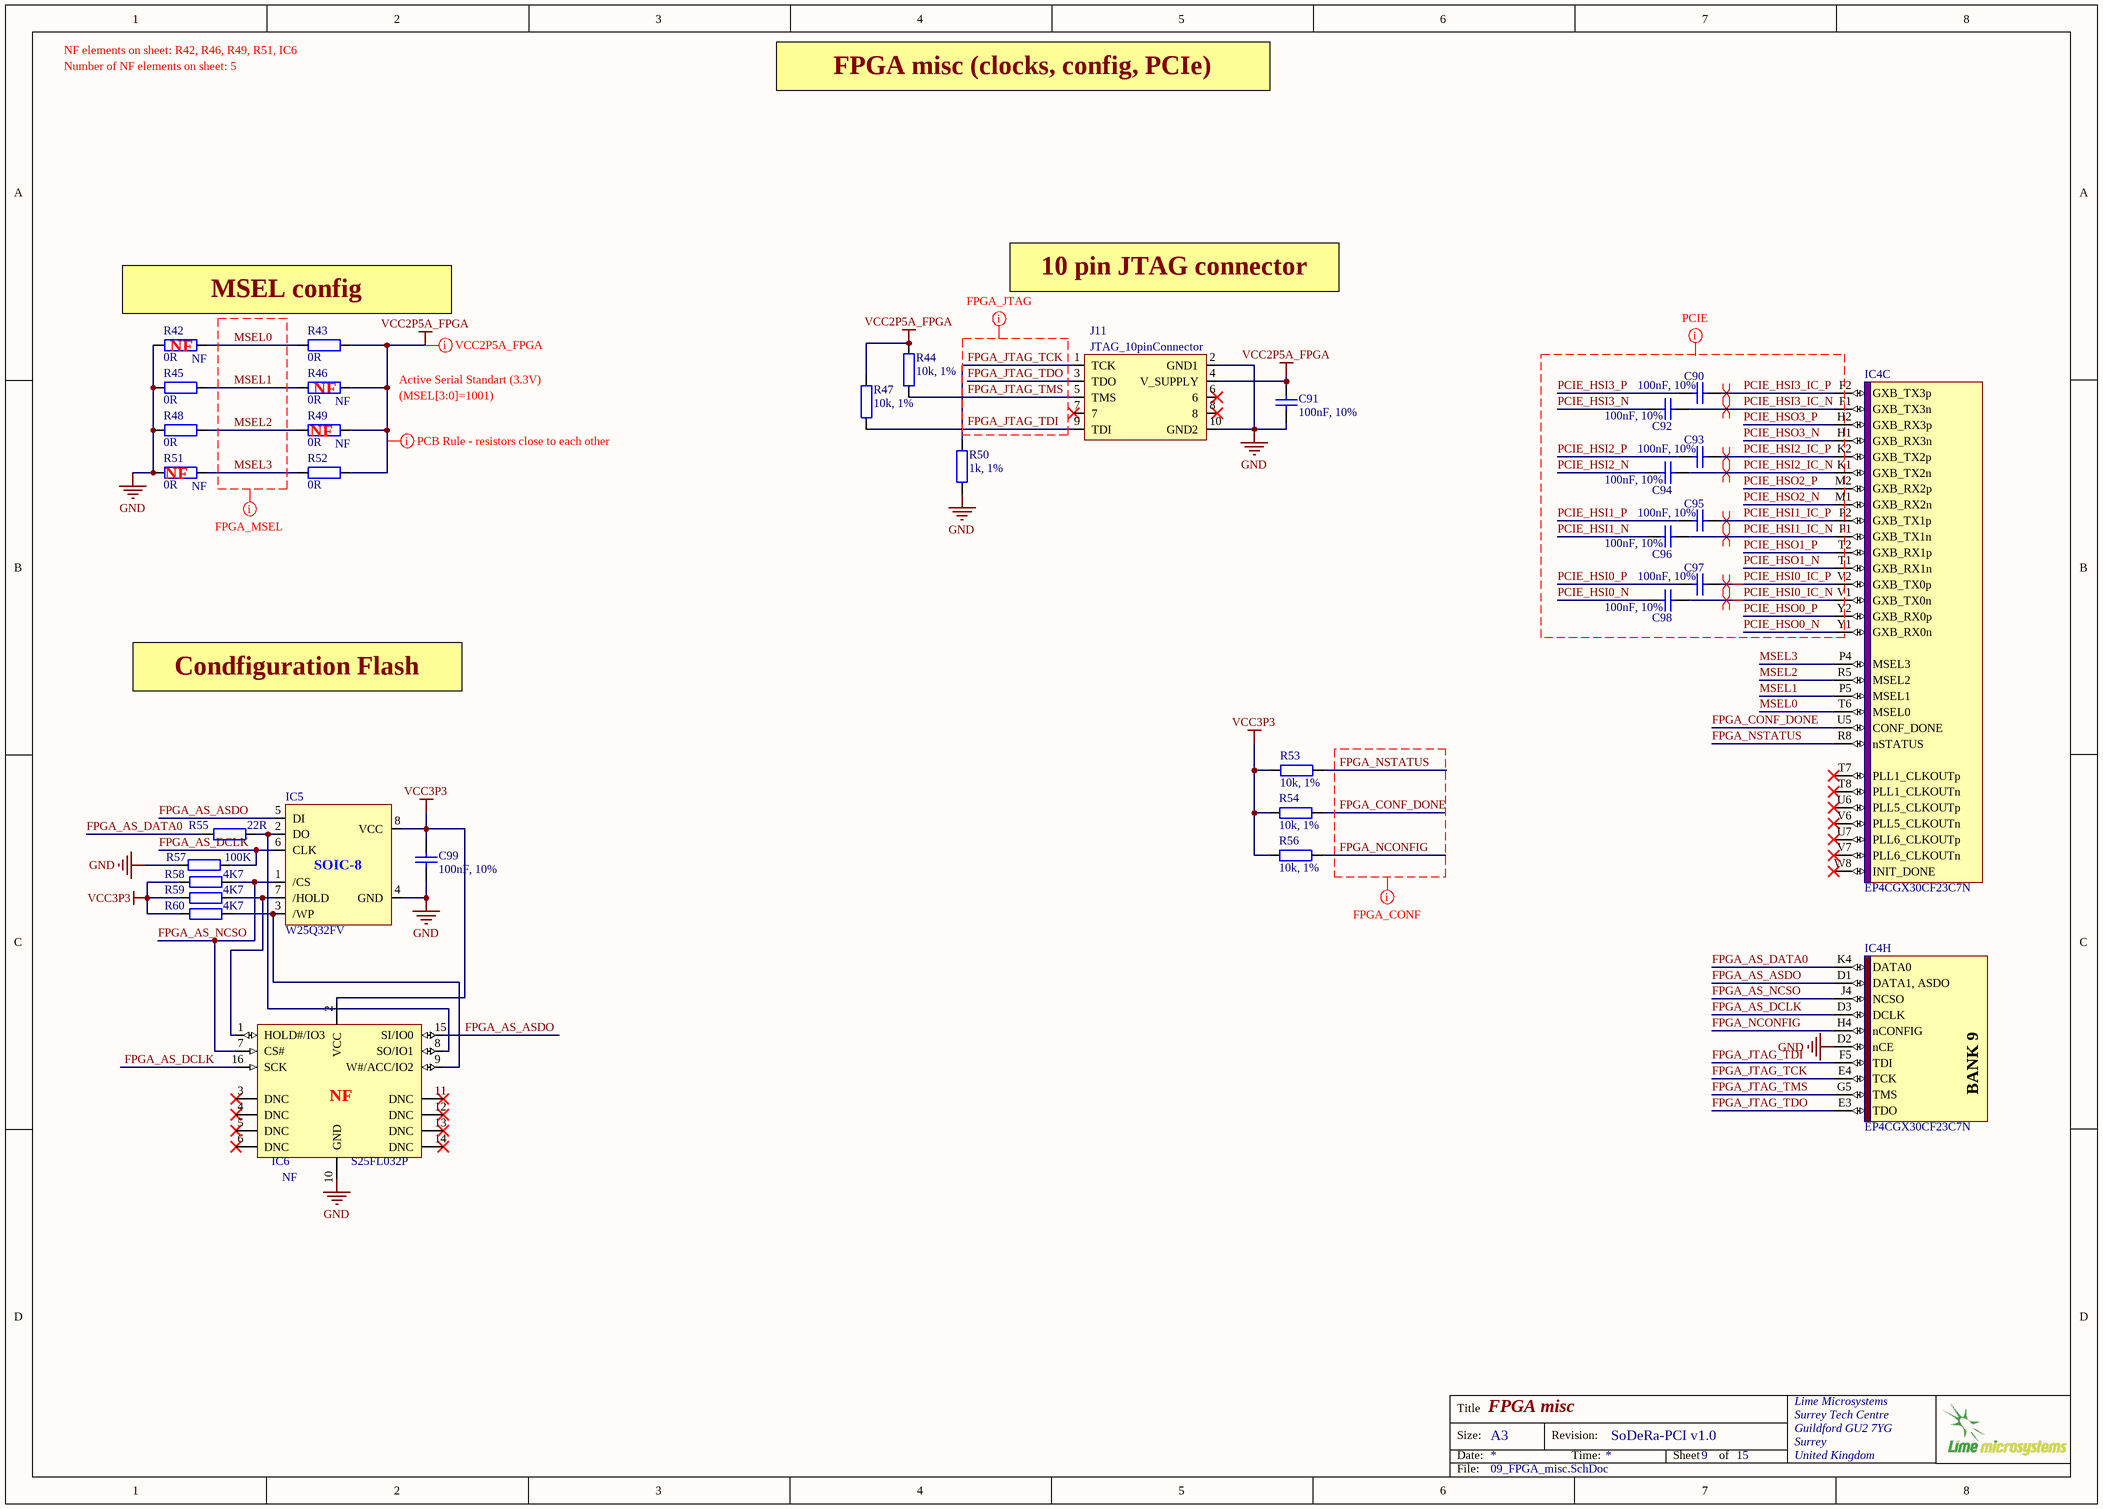
[diagram p4: 09_FPGA_misc.SchDoc]

### Parts
C90  100nF, 10%  [CAP0402]
C91  100nF, 10%  [CAP0402]
C92  100nF, 10%  [CAP0402]
C93  100nF, 10%  [CAP0402]
C94  100nF, 10%  [CAP0402]
C95  100nF, 10%  [CAP0402]
C96  100nF, 10%  [CAP0402]
C97  100nF, 10%  [CAP0402]
C98  100nF, 10%  [CAP0402]
C99  100nF, 10%  [CAP0402]
IC4  EP4CGX30CF23C7N  [ALTR-FBGA484_A-200]  (parts C,H of 10)
IC5  W25Q32FV  [SOIC127P600-8DL_v3]
IC6  S25FL032P  Assembly Info: NF  [SOIC16_WIDE]
J11  JTAG_10pinConnector  [HEADER5x2_SM]
R42  0R  Assembly Info: NF  [RES0402]
R43  0R  [RES0402]
R44  10k, 1%  [RES0402]
R45  0R  [RES0402]
R46  0R  Assembly Info: NF  [RES0402]
R47  10k, 1%  [RES0402]
R48  0R  [RES0402]
R49  0R  Assembly Info: NF  [RES0402]
R50  1k, 1%  [RES0402]
R51  0R  Assembly Info: NF  [RES0402]
R52  0R  [RES0402]
R53  10k, 1%  [RES0402]
R54  10k, 1%  [RES0402]
R55  22R  [RES0402]
R56  10k, 1%  [RES0402]
R57  100K  [RES0402]
R58  4K7  [RES0402]
R59  4K7  [RES0402]
R60  4K7  [RES0402]

### Nets
GND: C91.2 C99.2 IC4.D2(nCE) IC5.4(GND) IC6.10(GND) J11.2(GND1) J11.10(GND2) R42.2 R45.2 R48.2 R50.2 R51.2 R57.2
VCC2P5A_FPGA: C91.1 J11.4(V_SUPPLY) R43.1 R44.1 R46.1 R47.1 R49.1 R52.1
VCC3P3: C99.1 IC5.8(VCC) IC6.2(VCC) R53.1 R54.1 R56.1 R58.1 R59.1 R60.1
FPGA_AS_ASDO: IC4.D1(DATA1,_ASDO) IC5.5(DI) IC6.15(SI/IO0)
FPGA_AS_DATA0: IC4.K4(DATA0) R55.2
FPGA_AS_DCLK: IC4.D3(DCLK) IC5.6(CLK) IC6.16(SCK) R57.1
FPGA_AS_NCSO: IC4.J4(NCSO) IC5.1(/CS) IC6.7(CS#) R58.2
FPGA_CONF_DONE: IC4.U5(CONF_DONE) R54.2
FPGA_JTAG_TCK: IC4.E4(TCK) J11.1(TCK) R50.1
FPGA_JTAG_TDI: IC4.F5(TDI) J11.9(TDI) R47.2
FPGA_JTAG_TDO: IC4.E3(TDO) J11.3(TDO)
FPGA_JTAG_TMS: IC4.G5(TMS) J11.5(TMS) R44.2
FPGA_NCONFIG: IC4.H4(nCONFIG) R56.2
FPGA_NSTATUS: IC4.R8(nSTATUS) R53.2
MSEL0: IC4.T6(MSEL0) R42.1 R43.2
MSEL1: IC4.P5(MSEL1) R45.1 R46.2
MSEL2: IC4.R5(MSEL2) R48.1 R49.2
MSEL3: IC4.P4(MSEL3) R51.1 R52.2
PCIE_HSI0_IC_N: C98.1 IC4.V1(GXB_TX0n)
PCIE_HSI0_IC_P: C97.1 IC4.V2(GXB_TX0p)
PCIE_HSI0_N: C98.2
PCIE_HSI0_P: C97.2
PCIE_HSI1_IC_N: C96.1 IC4.P1(GXB_TX1n)
PCIE_HSI1_IC_P: C95.1 IC4.P2(GXB_TX1p)
PCIE_HSI1_N: C96.2
PCIE_HSI1_P: C95.2
PCIE_HSI2_IC_N: C94.1 IC4.K1(GXB_TX2n)
PCIE_HSI2_IC_P: C93.1 IC4.K2(GXB_TX2p)
PCIE_HSI2_N: C94.2
PCIE_HSI2_P: C93.2
PCIE_HSI3_IC_N: C92.1 IC4.F1(GXB_TX3n)
PCIE_HSI3_IC_P: C90.1 IC4.F2(GXB_TX3p)
PCIE_HSI3_N: C92.2
PCIE_HSI3_P: C90.2
PCIE_HSO0_N: IC4.Y1(GXB_RX0n)
PCIE_HSO0_P: IC4.Y2(GXB_RX0p)
PCIE_HSO1_N: IC4.T1(GXB_RX1n)
PCIE_HSO1_P: IC4.T2(GXB_RX1p)
PCIE_HSO2_N: IC4.M1(GXB_RX2n)
PCIE_HSO2_P: IC4.M2(GXB_RX2p)
PCIE_HSO3_N: IC4.H1(GXB_RX3n)
PCIE_HSO3_P: IC4.H2(GXB_RX3p)
NetIC5_2: IC5.2(DO) IC6.8(SO/IO1) R55.1
NetIC5_3: IC5.3(/WP) IC6.9(W#/ACC/IO2) R60.2
NetIC5_7: IC5.7(/HOLD) IC6.1(HOLD#/IO3) R59.2

Not connected (* = marked no-connect by the designer): IC4 T7(PLL1_CLKOUTp)* T8(PLL1_CLKOUTn)* U6(PLL5_CLKOUTp)* U7(PLL6_CLKOUTp)* V6(PLL5_CLKOUTn)* V7(PLL6_CLKOUTn)* W8(INIT_DONE)*; IC6 3(DNC)* 4(DNC)* 5(DNC)* 6(DNC)* 11(DNC)* 12(DNC)* 13(DNC)* 14(DNC)*; J11 6* 7* 8*

### Layout directives
net class FPGA_JTAG: FPGA_JTAG_TCK, FPGA_JTAG_TDI, FPGA_JTAG_TDO, FPGA_JTAG_TMS
net class FPGA_CONF: FPGA_CONF_DONE, FPGA_NCONFIG, FPGA_NSTATUS
rule Undefined: VCC2P5A_FPGA
net class FPGA_MSEL: MSEL0, MSEL1, MSEL2, MSEL3
differential pair: PCIE_HSI0_IC_N, PCIE_HSI0_IC_P, PCIE_HSI1_IC_N, PCIE_HSI1_IC_P, PCIE_HSI2_IC_N, PCIE_HSI2_IC_P, PCIE_HSI3_IC_N, PCIE_HSI3_IC_P
net class PCIE: PCIE_HSI0_IC_N, PCIE_HSI0_IC_P, PCIE_HSI0_N, PCIE_HSI0_P, PCIE_HSI1_IC_N, PCIE_HSI1_IC_P, PCIE_HSI1_N, PCIE_HSI1_P, PCIE_HSI2_IC_N, PCIE_HSI2_IC_P, PCIE_HSI2_N, PCIE_HSI2_P, PCIE_HSI3_IC_N, PCIE_HSI3_IC_P, PCIE_HSI3_N, PCIE_HSI3_P, PCIE_HSO0_N, PCIE_HSO0_P, PCIE_HSO1_N, PCIE_HSO1_P, PCIE_HSO2_N, PCIE_HSO2_P, PCIE_HSO3_N, PCIE_HSO3_P
net class VCC2P5A_FPGA: VCC2P5A_FPGA

### Notes on the sheet
- NF elements on sheet: R42, R46, R49, R51, IC6
- Number of NF elements on sheet: 5
- FPGA misc (clocks, config, PCIe)
- MSEL config
- 10 pin JTAG connector
- (near R42) NF
- Active Serial Standart (3.3V)
- (near R49) NF
- (near R46) NF
- (MSEL[3:0]=1001)
- (near R51) NF
- Condfiguration Flash
- (near IC6) NF
- Title
- Size:
- Date:
- A3
- Revision:
- Time:
- Sheet
- of
- File:
- (in symbol EP4CGX30CF23C7N, part H) BANK 9
- (in symbol W25Q32FV) SOIC-8

### Library data of the parts
C90-C98 = Cap_0603: Manufacturer: Murata; Brand: Murata Electronics; Type: General Purpose MLCC; Capacitance: 0.1 uF; Temperature Coefficient / Code: +/- 15 %; Voltage Rating DC: 16 V; Supplier 1: Mouser; Supplier Part Number 1: 81-GRM155R71C104KA88; Tolerance: 10 %; Case Code - in: 0402; Category: Multilayer Ceramic Capacitors MLCC - SMD/SMT; Value: 100nF, 10%
C99 = Cap_0603: as C81 on sheet 07_FPGA_banks_3_4_5; Supplier 1: Mouser; Supplier Part Number 1: 81-GRM155R71C104KA88; Tolerance: 10 %; Case Code - in: 0402; Category: Multilayer Ceramic Capacitors MLCC - SMD/SMT; Value: 100nF, 10%; Manufacturer Part Number: GRM155R71C104KA88D
IC4 = EP4CGX30CF23C7N: as IC4 on sheet 07_FPGA_banks_3_4_5; Supplier 1: Digi-Key; Package / Case: 484-BGA; Operating Temperature: 0°C ~ 85°C; Mounting Type: Surface Mount; Number of Gates: -; Supplier Device Package: 484-FBGA (23x23); Category: Integrated Circuits (ICs); RoHS: RoHS Compliant; Supplier Part Number 1: 544-2730-ND; Manufacturer Part Number 1: EP4CGX30CF23C7N
IC5 = W25Q32FV: Manufacturer: Winbond Electronics; Manufacturer Part Number 1: W25Q32FVSSIG; Voltage - Supply: 2.7 V ~ 3.6 V; Interface: SPI Serial; Memory Type: FLASH; Speed: 104MHz; Memory Size: 32M (4M x 8); Supplier 1: Digi-Key; Package / Case: 8-SOIC (0.209", 5.30mm Width); RoHS: RoHS Compliant; Packaging: Tube; Format - Memory: FLASH; Supplier Device Package: 8-SOIC; Operating Temperature: -40°C ~ 85°C; Category: Integrated Circuits (ICs); Supplier Part Number 1: W25Q32FVSSIG-ND
IC6 = S25FL032P: Manufacturer Part Number 1: S25FL032P0XMFI001; Manufacturer: Spansion; Speed: 104MHz; Interface: SPI Serial; Memory Size: 32M (4M x 8); Format - Memory: FLASH; Memory Type: FLASH - NOR; Voltage - Supply: 2.7 V ~ 3.6 V; Package / Case: 16-SOIC (0.295", 7.50mm Width); Supplier Device Package: 16-SOIC; Operating Temperature: -40°C ~ 85°C; RoHS: RoHS Compliant; Category: Integrated Circuits (ICs); Packaging: Tube; Supplier 1: Digi-Key; Supplier Part Number 1: S25FL032P0XMFI001-ND
J11 = JTAG_connector_10pin: Manufacturer Part Number 1: 54202-G0805LF; Connector Type: Header, Unshrouded; Number of Positions: 10; Number of Positions Loaded: All; Supplier 1: Digi-Key; Supplier Part Number 1: 609-4723-ND; Contact Type: Male Pin; Category: Connectors, Interconnects; Contact Finish: Gold or Gold, GXT™; Color: Black; Number of Rows: 2; Mounting Type: Surface Mount
R42 R43 R45 R46 R48 R49 R51 R52 = Res_0402: Manufacturer: Yageo; Supplier 1: Digi-Key; Supplier Part Number 1: 311-0.0JRTR-ND; Composition: Thick Film; Package / Case: 0402 (1005 Metric); Category: Resistors; Value: 0R
R44 R47 R53 R54 R56 = Res_0402: as R2 on sheet 04_LMS7002M_Digital; Value: 10k, 1%; Supplier 1: Digi-Key; Supplier Part Number 1: 311-10.0KLRTR-ND; Resistance (Ohms): 10k; Packaging: Tape & Reel (TR); RoHS: RoHS Compliant; Package / Case: 0402 (1005 Metric); Tolerance: ±1%; Operating Temperature: -55°C ~ 155°C; Size / Dimension: 0.039" L x 0.020" W (1.00mm x 0.50mm); Number of Terminations: 2; Category: Resistors; Height: 0.016" (0.40mm); Supplier Device Package: 0402; Features: Moisture Resistant; Composition: Thick Film
R50 = Res_0402: Manufacturer: Stackpole Electronics Inc; Manufacturer Part Number 1: RMCF0402FT1K00; Temperature Coefficient: ±100ppm/°C; Power (Watts): 0.063W, 1/16W; Value: 1k, 1%; Supplier 1: Digi-Key; Supplier Part Number 1: RMCF0402FT1K00TR-ND; Package / Case: 0402 (1005 Metric); Supplier Device Package: 0402; Height: 0.016" (0.40mm); Size / Dimension: 0.039" L x 0.020" W (1.00mm x 0.50mm); Number of Terminations: 2; Packaging: Cut Tape (CT); Category: Resistors; Composition: Thick Film; Resistance (Ohms): 1k; Tolerance: ±1%; Features: Moisture Resistant; Operating Temperature: -55°C ~ 155°C; RoHS: RoHS Compliant
R55 = Res_0402: Tolerance: ±1%; Temperature Coefficient: ±100ppm/°C; Resistance (Ohms): 22; Supplier 1: Digi-Key; Supplier Part Number 1: 311-22.0LRTR-ND; Supplier Device Package: 0402; Composition: Thick Film; Category: Resistors; Value: 22R
R57 = Res_0402: Manufacturer Part Number 1: ERJ-2GEJ104X; Manufacturer: Panasonic Electronic Components; Tolerance: ±5%; Temperature Coefficient: ±200ppm/°C; Power (Watts): 0.1W, 1/10W; Supplier 1: Digi-Key; Supplier Part Number 1: P100KJCT-ND; Resistance (Ohms): 100k; Composition: Thick Film; Features: Automotive AEC-Q200; Number of Terminations: 2; Height: 0.016" (0.40mm); RoHS: RoHS Compliant; Package / Case: 0402 (1005 Metric); Packaging: Cut Tape (CT); Size / Dimension: 0.039" L x 0.020" W (1.00mm x 0.50mm); Supplier Device Package: 0402; Operating Temperature: -55°C ~ 155°C; Category: Resistors; value: 100K
R58-R60 = Res_0402: Manufacturer Part Number 1: RMCF0402JT4K70; Temperature Coefficient: ±100ppm/°C; Resistance(Ohms): 4.7k; Tolerance: ±5%; Supplier 1: Digi-Key; Composition: Thick Film; Supplier Device Package: 0402; Supplier: Digi-Key; Supplier Part Number 1: RMCF0402JT4K70TR-ND; Category: Resistors; Value: 4K7

## Sheet 11_DDR2.SchDoc: DDR2
size A3; Organization: Lime Microsystems; Address1: Surrey Tech Centre; Address2: Guildford GU2 7YG; Address3: Surrey; Address4: United Kingdom; Revision: SoDeRa-PCI v1.0; SheetNumber: 11; SheetTotal: 15
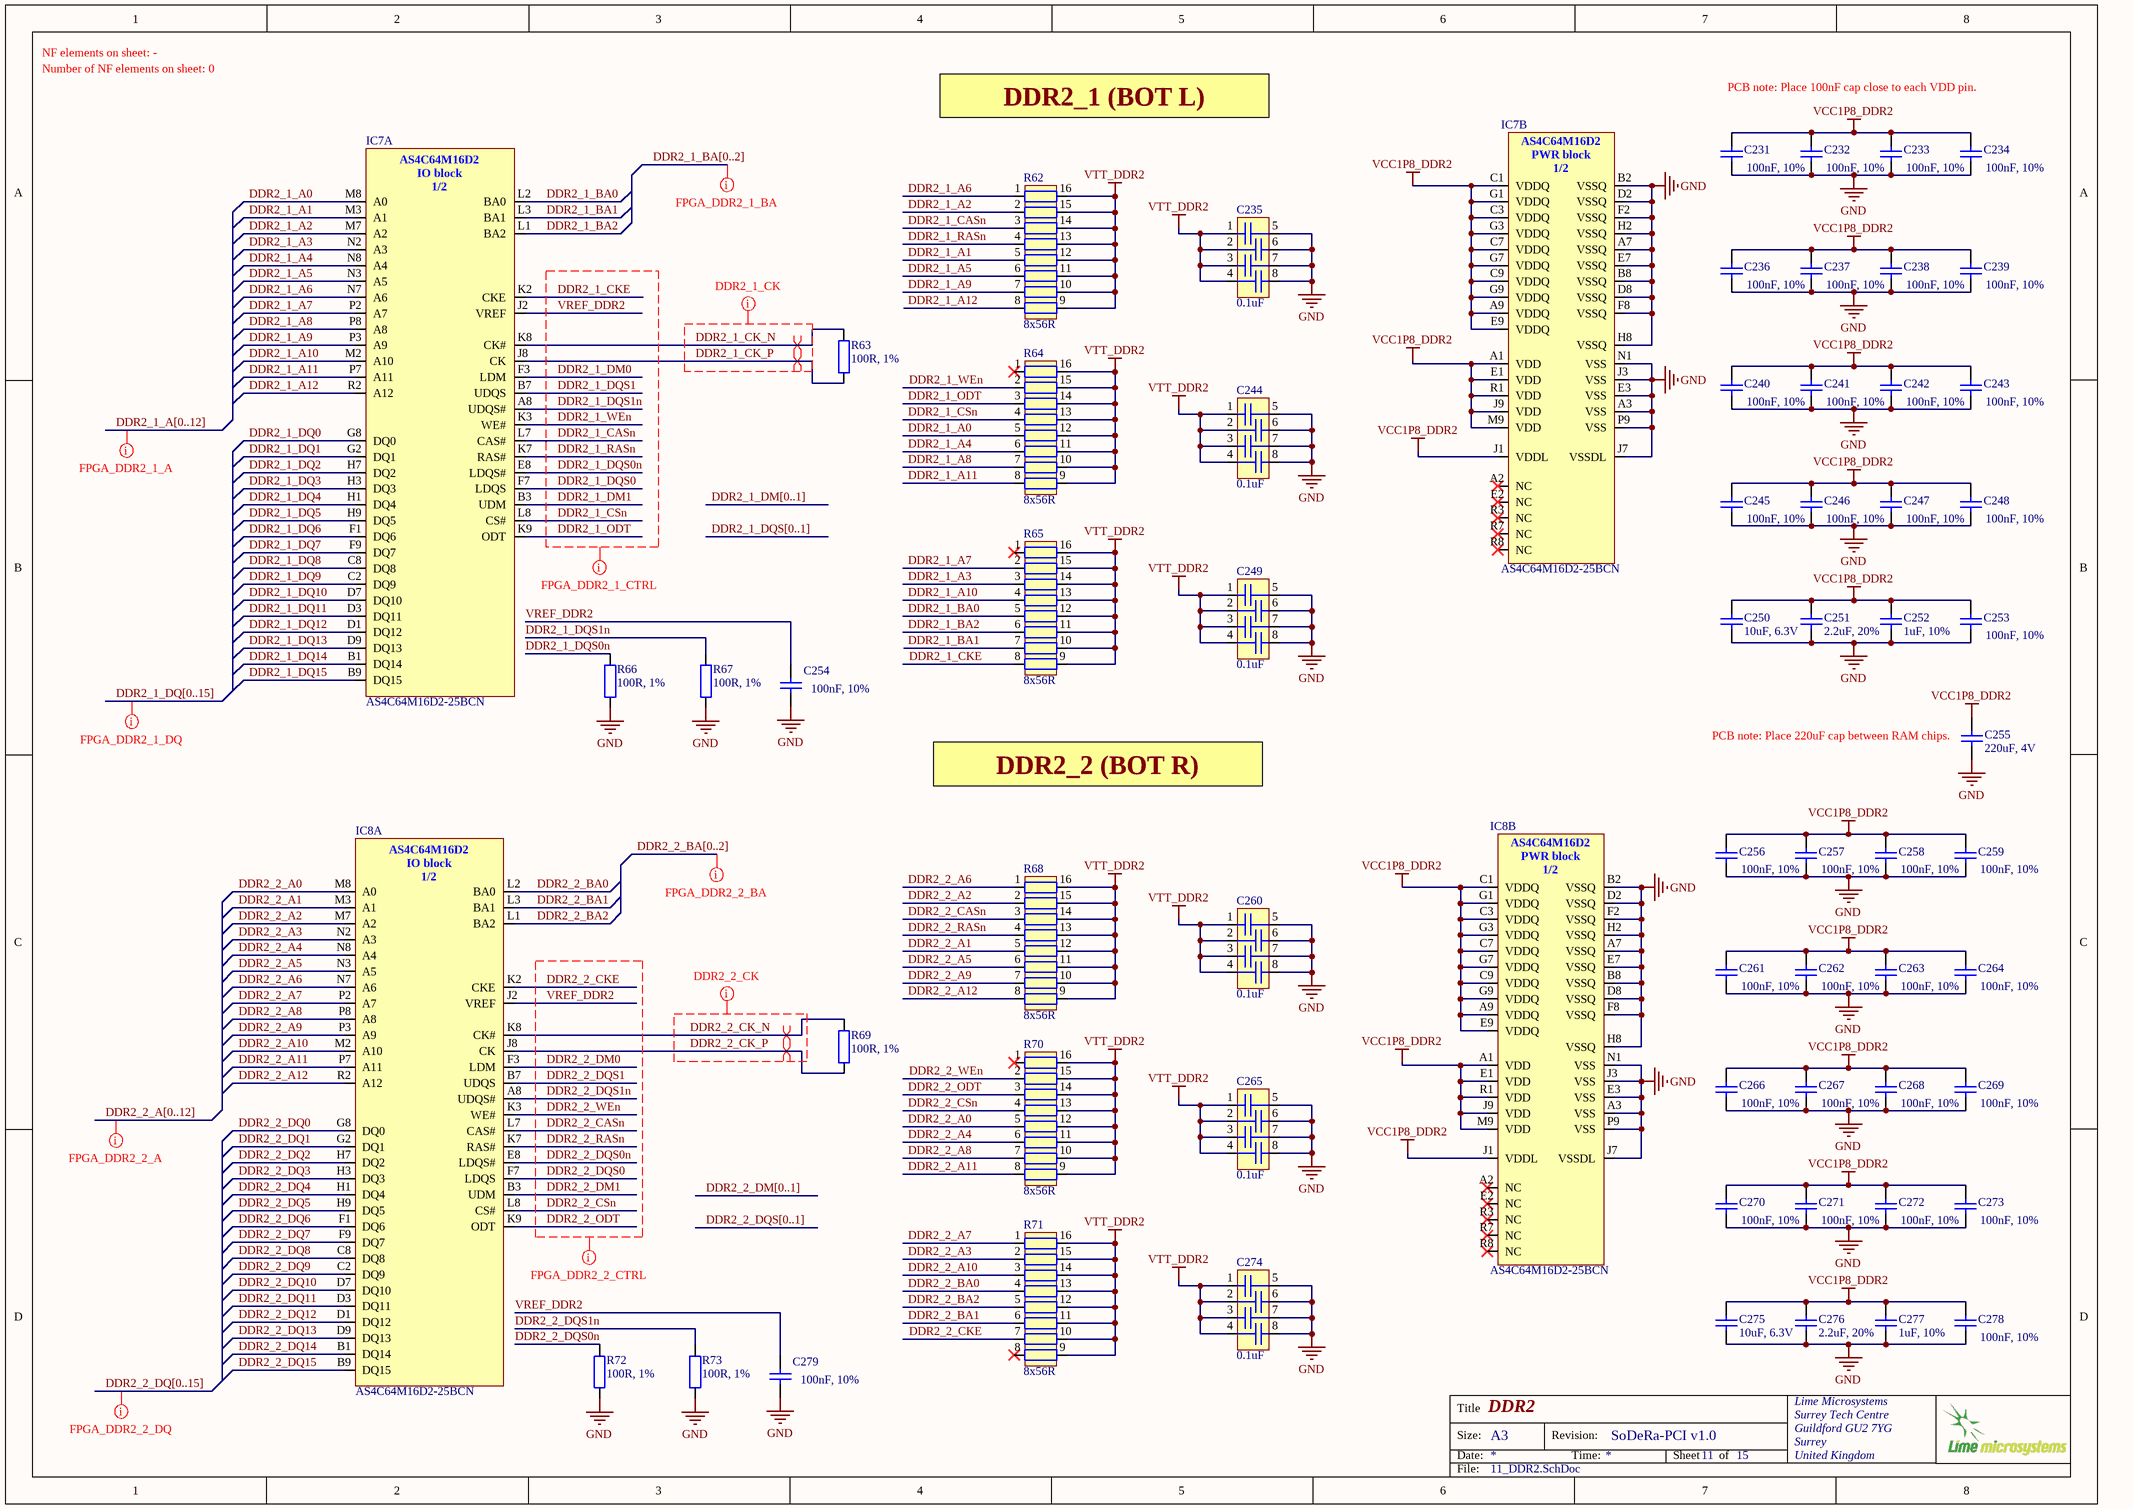
[diagram p5: 11_DDR2.SchDoc]

### Parts
C231  100nF, 10%  [CAP0402]
C232  100nF, 10%  [CAP0402]
C233  100nF, 10%  [CAP0402]
C234  100nF, 10%  [CAP0402]
C235  0.1uF  [CKCA43X7R1C104M100AA]
C236  100nF, 10%  [CAP0402]
C237  100nF, 10%  [CAP0402]
C238  100nF, 10%  [CAP0402]
C239  100nF, 10%  [CAP0402]
C240  100nF, 10%  [CAP0402]
C241  100nF, 10%  [CAP0402]
C242  100nF, 10%  [CAP0402]
C243  100nF, 10%  [CAP0402]
C244  0.1uF  [CKCA43X7R1C104M100AA]
C245  100nF, 10%  [CAP0402]
C246  100nF, 10%  [CAP0402]
C247  100nF, 10%  [CAP0402]
C248  100nF, 10%  [CAP0402]
C249  0.1uF  [CKCA43X7R1C104M100AA]
C250  10uF, 6.3V  [CAP0603]
C251  2.2uF, 20%  [CAP0402]
C252  1uF, 10%  [CAP0402]
C253  100nF, 10%  [CAP0402]
C254  100nF, 10%  [CAP0402]
C255  220uF, 4V  [CAP1206]
C256  100nF, 10%  [CAP0402]
C257  100nF, 10%  [CAP0402]
C258  100nF, 10%  [CAP0402]
C259  100nF, 10%  [CAP0402]
C260  0.1uF  [CKCA43X7R1C104M100AA]
C261  100nF, 10%  [CAP0402]
C262  100nF, 10%  [CAP0402]
C263  100nF, 10%  [CAP0402]
C264  100nF, 10%  [CAP0402]
C265  0.1uF  [CKCA43X7R1C104M100AA]
C266  100nF, 10%  [CAP0402]
C267  100nF, 10%  [CAP0402]
C268  100nF, 10%  [CAP0402]
C269  100nF, 10%  [CAP0402]
C270  100nF, 10%  [CAP0402]
C271  100nF, 10%  [CAP0402]
C272  100nF, 10%  [CAP0402]
C273  100nF, 10%  [CAP0402]
C274  0.1uF  [CKCA43X7R1C104M100AA]
C275  10uF, 6.3V  [CAP0603]
C276  2.2uF, 20%  [CAP0402]
C277  1uF, 10%  [CAP0402]
C278  100nF, 10%  [CAP0402]
C279  100nF, 10%  [CAP0402]
IC7  AS4C64M16D2-25BCN  [AS4C64M16D2]  (parts A,B of 2)
IC8  AS4C64M16D2-25BCN  [AS4C64M16D2]  (parts A,B of 2)
R62  8x56R  [EXB2HV]
R63  100R, 1%  [RES0402]
R64  8x56R  [EXB2HV]
R65  8x56R  [EXB2HV]
R66  100R, 1%  [RES0402]
R67  100R, 1%  [RES0402]
R68  8x56R  [EXB2HV]
R69  100R, 1%  [RES0402]
R70  8x56R  [EXB2HV]
R71  8x56R  [EXB2HV]
R72  100R, 1%  [RES0402]
R73  100R, 1%  [RES0402]

### Nets
GND: C231.2 C232.2 C233.2 C234.2 C235.5 C235.6 C235.7 C235.8 C236.2 C237.2 C238.2 C239.2 C240.2 C241.2 C242.2 C243.2 C244.5 C244.6 C244.7 C244.8 C245.2 C246.2 C247.2 C248.2 C249.5 C249.6 C249.7 C249.8 C250.1 C251.1 C252.1 C253.2 C254.2 C255.1 C256.2 C257.2 C258.2 C259.2 C260.5 C260.6 C260.7 C260.8 C261.2 C262.2 C263.2 C264.2 C265.5 C265.6 C265.7 C265.8 C266.2 C267.2 C268.2 C269.2 C270.2 C271.2 C272.2 C273.2 C274.5 C274.6 C274.7 C274.8 C275.1 C276.1 C277.1 C278.2 C279.2 IC7.A3(VSS) IC7.A7(VSSQ) IC7.B2(VSSQ) IC7.B8(VSSQ) IC7.D2(VSSQ) IC7.D8(VSSQ) IC7.E3(VSS) IC7.E7(VSSQ) IC7.F2(VSSQ) IC7.F8(VSSQ) IC7.H2(VSSQ) IC7.H8(VSSQ) IC7.J3(VSS) IC7.J7(VSSDL) IC7.N1(VSS) IC7.P9(VSS) IC8.A3(VSS) IC8.A7(VSSQ) IC8.B2(VSSQ) IC8.B8(VSSQ) IC8.D2(VSSQ) IC8.D8(VSSQ) IC8.E3(VSS) IC8.E7(VSSQ) IC8.F2(VSSQ) IC8.F8(VSSQ) IC8.H2(VSSQ) IC8.H8(VSSQ) IC8.J3(VSS) IC8.J7(VSSDL) IC8.N1(VSS) IC8.P9(VSS) R66.1 R67.1 R72.1 R73.1
VCC1P8_DDR2: C231.1 C232.1 C233.1 C234.1 C236.1 C237.1 C238.1 C239.1 C240.1 C241.1 C242.1 C243.1 C245.1 C246.1 C247.1 C248.1 C250.2 C251.2 C252.2 C253.1 C255.2 C256.1 C257.1 C258.1 C259.1 C261.1 C262.1 C263.1 C264.1 C266.1 C267.1 C268.1 C269.1 C270.1 C271.1 C272.1 C273.1 C275.2 C276.2 C277.2 C278.1 IC7.A1(VDD) IC7.A9(VDDQ) IC7.C1(VDDQ) IC7.C3(VDDQ) IC7.C7(VDDQ) IC7.C9(VDDQ) IC7.E1(VDD) IC7.E9(VDDQ) IC7.G1(VDDQ) IC7.G3(VDDQ) IC7.G7(VDDQ) IC7.G9(VDDQ) IC7.J1(VDDL) IC7.J9(VDD) IC7.M9(VDD) IC7.R1(VDD) IC8.A1(VDD) IC8.A9(VDDQ) IC8.C1(VDDQ) IC8.C3(VDDQ) IC8.C7(VDDQ) IC8.C9(VDDQ) IC8.E1(VDD) IC8.E9(VDDQ) IC8.G1(VDDQ) IC8.G3(VDDQ) IC8.G7(VDDQ) IC8.G9(VDDQ) IC8.J1(VDDL) IC8.J9(VDD) IC8.M9(VDD) IC8.R1(VDD)
VREF_DDR2: C254.1 C279.1 IC7.J2(VREF) IC8.J2(VREF)
VTT_DDR2: C235.1 C235.2 C235.3 C235.4 C244.1 C244.2 C244.3 C244.4 C249.1 C249.2 C249.3 C249.4 C260.1 C260.2 C260.3 C260.4 C265.1 C265.2 C265.3 C265.4 C274.1 C274.2 C274.3 C274.4 R62.9 R62.10 R62.11 R62.12 R62.13 R62.14 R62.15 R62.16 R64.9 R64.10 R64.11 R64.12 R64.13 R64.14 R64.15 R64.16 R65.9 R65.10 R65.11 R65.12 R65.13 R65.14 R65.15 R65.16 R68.9 R68.10 R68.11 R68.12 R68.13 R68.14 R68.15 R68.16 R70.9 R70.10 R70.11 R70.12 R70.13 R70.14 R70.15 R70.16 R71.9 R71.10 R71.11 R71.12 R71.13 R71.14 R71.15 R71.16
DDR2_1_A0: IC7.M8(A0) R64.5
DDR2_1_A1: IC7.M3(A1) R62.5
DDR2_1_A2: IC7.M7(A2) R62.2
DDR2_1_A3: IC7.N2(A3) R65.3
DDR2_1_A4: IC7.N8(A4) R64.6
DDR2_1_A5: IC7.N3(A5) R62.6
DDR2_1_A6: IC7.N7(A6) R62.1
DDR2_1_A7: IC7.P2(A7) R65.2
DDR2_1_A8: IC7.P8(A8) R64.7
DDR2_1_A9: IC7.P3(A9) R62.7
DDR2_1_A10: IC7.M2(A10) R65.4
DDR2_1_A11: IC7.P7(A11) R64.8
DDR2_1_A12: IC7.R2(A12) R62.8
DDR2_1_BA0: IC7.L2(BA0) R65.5
DDR2_1_BA1: IC7.L3(BA1) R65.7
DDR2_1_BA2: IC7.L1(BA2) R65.6
DDR2_1_CASn: IC7.L7(CAS#) R62.3
DDR2_1_CK_N: IC7.K8(CK#) R63.2
DDR2_1_CK_P: IC7.J8(CK) R63.1
DDR2_1_CKE: IC7.K2(CKE) R65.8
DDR2_1_CSn: IC7.L8(CS#) R64.4
DDR2_1_DM0: IC7.F3(LDM)
DDR2_1_DM1: IC7.B3(UDM)
DDR2_1_DQ0: IC7.G8(DQ0)
DDR2_1_DQ1: IC7.G2(DQ1)
DDR2_1_DQ2: IC7.H7(DQ2)
DDR2_1_DQ3: IC7.H3(DQ3)
DDR2_1_DQ4: IC7.H1(DQ4)
DDR2_1_DQ5: IC7.H9(DQ5)
DDR2_1_DQ6: IC7.F1(DQ6)
DDR2_1_DQ7: IC7.F9(DQ7)
DDR2_1_DQ8: IC7.C8(DQ8)
DDR2_1_DQ9: IC7.C2(DQ9)
DDR2_1_DQ10: IC7.D7(DQ10)
DDR2_1_DQ11: IC7.D3(DQ11)
DDR2_1_DQ12: IC7.D1(DQ12)
DDR2_1_DQ13: IC7.D9(DQ13)
DDR2_1_DQ14: IC7.B1(DQ14)
DDR2_1_DQ15: IC7.B9(DQ15)
DDR2_1_DQS0: IC7.F7(LDQS)
DDR2_1_DQS0n: IC7.E8(LDQS#) R66.2
DDR2_1_DQS1: IC7.B7(UDQS)
DDR2_1_DQS1n: IC7.A8(UDQS#) R67.2
DDR2_1_ODT: IC7.K9(ODT) R64.3
DDR2_1_RASn: IC7.K7(RAS#) R62.4
DDR2_1_WEn: IC7.K3(WE#) R64.2
DDR2_2_A0: IC8.M8(A0) R70.5
DDR2_2_A1: IC8.M3(A1) R68.5
DDR2_2_A2: IC8.M7(A2) R68.2
DDR2_2_A3: IC8.N2(A3) R71.2
DDR2_2_A4: IC8.N8(A4) R70.6
DDR2_2_A5: IC8.N3(A5) R68.6
DDR2_2_A6: IC8.N7(A6) R68.1
DDR2_2_A7: IC8.P2(A7) R71.1
DDR2_2_A8: IC8.P8(A8) R70.7
DDR2_2_A9: IC8.P3(A9) R68.7
DDR2_2_A10: IC8.M2(A10) R71.3
DDR2_2_A11: IC8.P7(A11) R70.8
DDR2_2_A12: IC8.R2(A12) R68.8
DDR2_2_BA0: IC8.L2(BA0) R71.4
DDR2_2_BA1: IC8.L3(BA1) R71.6
DDR2_2_BA2: IC8.L1(BA2) R71.5
DDR2_2_CASn: IC8.L7(CAS#) R68.3
DDR2_2_CK_N: IC8.K8(CK#) R69.2
DDR2_2_CK_P: IC8.J8(CK) R69.1
DDR2_2_CKE: IC8.K2(CKE) R71.7
DDR2_2_CSn: IC8.L8(CS#) R70.4
DDR2_2_DM0: IC8.F3(LDM)
DDR2_2_DM1: IC8.B3(UDM)
DDR2_2_DQ0: IC8.G8(DQ0)
DDR2_2_DQ1: IC8.G2(DQ1)
DDR2_2_DQ2: IC8.H7(DQ2)
DDR2_2_DQ3: IC8.H3(DQ3)
DDR2_2_DQ4: IC8.H1(DQ4)
DDR2_2_DQ5: IC8.H9(DQ5)
DDR2_2_DQ6: IC8.F1(DQ6)
DDR2_2_DQ7: IC8.F9(DQ7)
DDR2_2_DQ8: IC8.C8(DQ8)
DDR2_2_DQ9: IC8.C2(DQ9)
DDR2_2_DQ10: IC8.D7(DQ10)
DDR2_2_DQ11: IC8.D3(DQ11)
DDR2_2_DQ12: IC8.D1(DQ12)
DDR2_2_DQ13: IC8.D9(DQ13)
DDR2_2_DQ14: IC8.B1(DQ14)
DDR2_2_DQ15: IC8.B9(DQ15)
DDR2_2_DQS0: IC8.F7(LDQS)
DDR2_2_DQS0n: IC8.E8(LDQS#) R72.2
DDR2_2_DQS1: IC8.B7(UDQS)
DDR2_2_DQS1n: IC8.A8(UDQS#) R73.2
DDR2_2_ODT: IC8.K9(ODT) R70.3
DDR2_2_RASn: IC8.K7(RAS#) R68.4
DDR2_2_WEn: IC8.K3(WE#) R70.2

Not connected (* = marked no-connect by the designer): IC7 A2(NC)* E2(NC)* R3(NC)* R7(NC)* R8(NC)*; IC8 A2(NC)* E2(NC)* R3(NC)* R7(NC)* R8(NC)*; R64 1*; R65 1*; R70 1*; R71 8*

### Buses and harness runs
bus DDR2_1_A[0..12]
bus DDR2_1_BA[0..2]
bus DDR2_1_DM[0..1]
bus DDR2_1_DQ[0..15]
bus DDR2_1_DQS[0..1]
bus DDR2_2_A[0..12]
bus DDR2_2_BA[0..2]
bus DDR2_2_DM[0..1]
bus DDR2_2_DQ[0..15]
bus DDR2_2_DQS[0..1]

### Layout directives
net class FPGA_DDR0_DQ: (no net found under the mark)
net class FPGA_DDR0_BA: (no net found under the mark)
net class FPGA_DDR0_CTRL: DDR2_1_CASn, DDR2_1_CKE, DDR2_1_CSn, DDR2_1_DM0, DDR2_1_DM1, DDR2_1_DQS0, DDR2_1_DQS0n, DDR2_1_DQS1, DDR2_1_DQS1n, DDR2_1_ODT, DDR2_1_RASn, DDR2_1_WEn, VREF_DDR2
net class FPGA_DDR0_A: (no net found under the mark)
net class FPGA_DDR1_DQ: (no net found under the mark)
net class FPGA_DDR1_BA: (no net found under the mark)
net class FPGA_DDR1_CTRL: DDR2_2_CASn, DDR2_2_CKE, DDR2_2_CSn, DDR2_2_DM0, DDR2_2_DM1, DDR2_2_DQS0, DDR2_2_DQS0n, DDR2_2_DQS1, DDR2_2_DQS1n, DDR2_2_ODT, DDR2_2_RASn, DDR2_2_WEn, VREF_DDR2
net class FPGA_DDR1_A: (no net found under the mark)
differential pair: DDR2_1_CK_N, DDR2_1_CK_P, DDR2_2_CK_N, DDR2_2_CK_P
net class DDR2_2_CK: DDR2_2_CK_N, DDR2_2_CK_P
net class DDR2_1_CK: DDR2_1_CK_N, DDR2_1_CK_P

### Notes on the sheet
- Number of NF elements on sheet: 0
- NF elements on sheet: -
- DDR2_1 (BOT L)
- PCB note: Place 100nF cap close to each VDD pin.
- DDR2_2 (BOT R)
- (near C255) PCB note: Place 220uF cap between RAM chips.
- Title
- Size:
- Date:
- A3
- Revision:
- Time:
- Sheet
- of
- File:
- (in symbol AS4C64M16D2-25BCN, part A) AS4C64M16D2 / IO block / 1/2
- (in symbol AS4C64M16D2-25BCN, part B) AS4C64M16D2 / PWR block / 1/2

### Library data of the parts
C231-C234 C236-C243 C245-C248 C253 C254 C256-C259 C261-C264 C266-C273 C278 C279 = Cap_0603: as C81 on sheet 07_FPGA_banks_3_4_5; Supplier 1: Mouser; Supplier Part Number 1: 81-GRM155R71C104KA88; Tolerance: 10 %; Case Code - in: 0402; Category: Multilayer Ceramic Capacitors MLCC - SMD/SMT; Value: 100nF, 10%; Manufacturer Part Number: GRM155R71C104KA88D
C235 C244 C249 C260 C265 C274 = 4X_cap_array_1206: Manufacturer: TDK; Case Height: 1 mm; Case Length: 3.2 mm; Case Width: 1.6 mm; Voltage Rating: 16 V; Number of Elements: 4; Tolerance: 20 %; Temperature Coefficient / Code: X7R; Value: 0.1uF; Supplier 1: Mouser; Supplier Part Number 1: 810-CKCA43X7R1C104M; RoHS: RoHS Compliant; Termination Style: SMD/SMT; Brand: TDK; Category: Capacitor Arrays & Networks; Product: Ceramic Capacitor Arrays; Series: CKC; Packaging: Reel; Operating Temperature Range: - 55 C to + 125 C; Manufacturer Part Number 1: CKCA43X7R1C104M100AA; Capacitance: 0.1 uF; Product Category: Capacitor Arrays; Standard Pack Qty: 2000; RoHS - Mouser: Y; Minimum Order Quantity: 1; Reeling: True
C250 C275 = Cap_0603: Manufacturer Part Number 1: CC0603MRX5R5BB106; Capacitance: 10µF; Tolerance: ±20%; Supplier 1: Digi-Key; Supplier Part Number 1: 311-1448-2-ND; Package / Case: 0603 (1608 Metric); Category: Capacitors; Voltage - Rated: 6.3V; Value: 10uF, 6.3V
C251 C276 = Cap_0402: Manufacturer Part Number 1: C1005X5R1C225K050BC; Manufacturer: TDK Corporation; Voltage - Rated: 16V; Temperature Coefficient: X5R; Capacitance: 2.2µF; Value: 2.2uF, 20%; Supplier 1: Digi-Key; Supplier Part Number 1: 445-9085-1-ND; Category: Capacitors; Thickness (Max): 0.022" (0.55mm); Applications: General Purpose; Package / Case: 0402 (1005 Metric); Size / Dimension: 0.039" L x 0.020" W (1.00mm x 0.50mm); Features: -; Mounting Type: Surface Mount, MLCC; Ratings: -; Lead Style: -; Operating Temperature: -55°C ~ 85°C; Lead Spacing: -; RoHS: RoHS Compliant; Height - Seated (Max): -; Tolerance: ±20%; Packaging: Tape & Reel (TR)
C252 C277 = Cap_0402: as C2 on sheet 04_LMS7002M_Digital; Value: 1uF, 10%; Supplier 1: Newark; Supplier Part Number 1: 490-6298-2-ND; Capacitance Tolerance: ± 10%; MSL: -; RoHS: YES
C255 = Cap_1206: Manufacturer Part Number: GRM31CR60G227ME11L; Manufacturer: Murata Electronics North America; Capacitance: 220µF; Temperature Coefficient: X5R; Tolerance: ±20%; Package / Case: 1206 (3216 Metric); Supplier 1: Digi-Key; Packaging: Cut Tape (CT); Size / Dimension: 0.126" L x 0.063" W (3.20mm x 1.60mm); Operating Temperature: -55°C ~ 85°C; Voltage - Rated: 4V; Mounting Type: Surface Mount, MLCC; Ratings: -; Supplier Part Number 1: 490-9774-1-ND; Category: Capacitors; Lead Spacing: -; Lead Style: -; Applications: General Purpose; Features: -; Height - Seated (Max): -; Thickness (Max): 0.075" (1.90mm); RoHS: RoHS Compliant; Value: 220uF, 4V
IC7 IC8 = AS4C64M16D2-25BCN: Manufacturer: Alliance Memory, Inc.; Speed: 400MHz; Interface: Parallel; Memory Type: DDR2 SDRAM; Memory Size: 1G (64M x 16); Voltage - Supply: 1.7 V ~ 1.9 V; Format - Memory: RAM; Supplier 1: Digi-Key; Package / Case: 84-TFBGA; Supplier Device Package: 84-FBGA (8x12.5); Manufacturer Part Number 1: AS4C64M16D2-25BCN; RoHS: RoHS Compliant; Operating Temperature: 0°C ~ 70°C; Category: Integrated Circuits (ICs); Packaging: Tray; Supplier Part Number 1: 1450-1158-ND
R62 R64 R65 R68 R70 R71 = 8X_resistor_array_0402: Manufacturer Part Number 1: EXB2HV560JV; Manufacturer: PANASONIC ELECTRONIC COMPONENTS; Supplier 1: Farnell; Supplier Part Number 1: 2060070; RoHS: YES
R63 R66 R67 R69 R72 R73 = Res_0402: Manufacturer Part Number 1: RMCF0402FT100R; Temperature Coefficient: ±100ppm/°C; Supplier 1: Digi-Key; Supplier Part Number 1: RMCF0402FT100RDKR-ND; Package / Case: 0402 (1005 Metric); Composition: Thick Film; Category: Resistors; Tolerance: ±1%; Value: 100R, 1%